# EasyEDA Pro project ProPrj_共享电动车中控.epro, schematic SCH

## Sheets
1 P1: Board Name: STM32F103C8T6; Create Date: 2024-09-26; Page Name: P1; Project Name: 电动车中控1; Schematic Name: SCH; Update Date: 2024-10-22
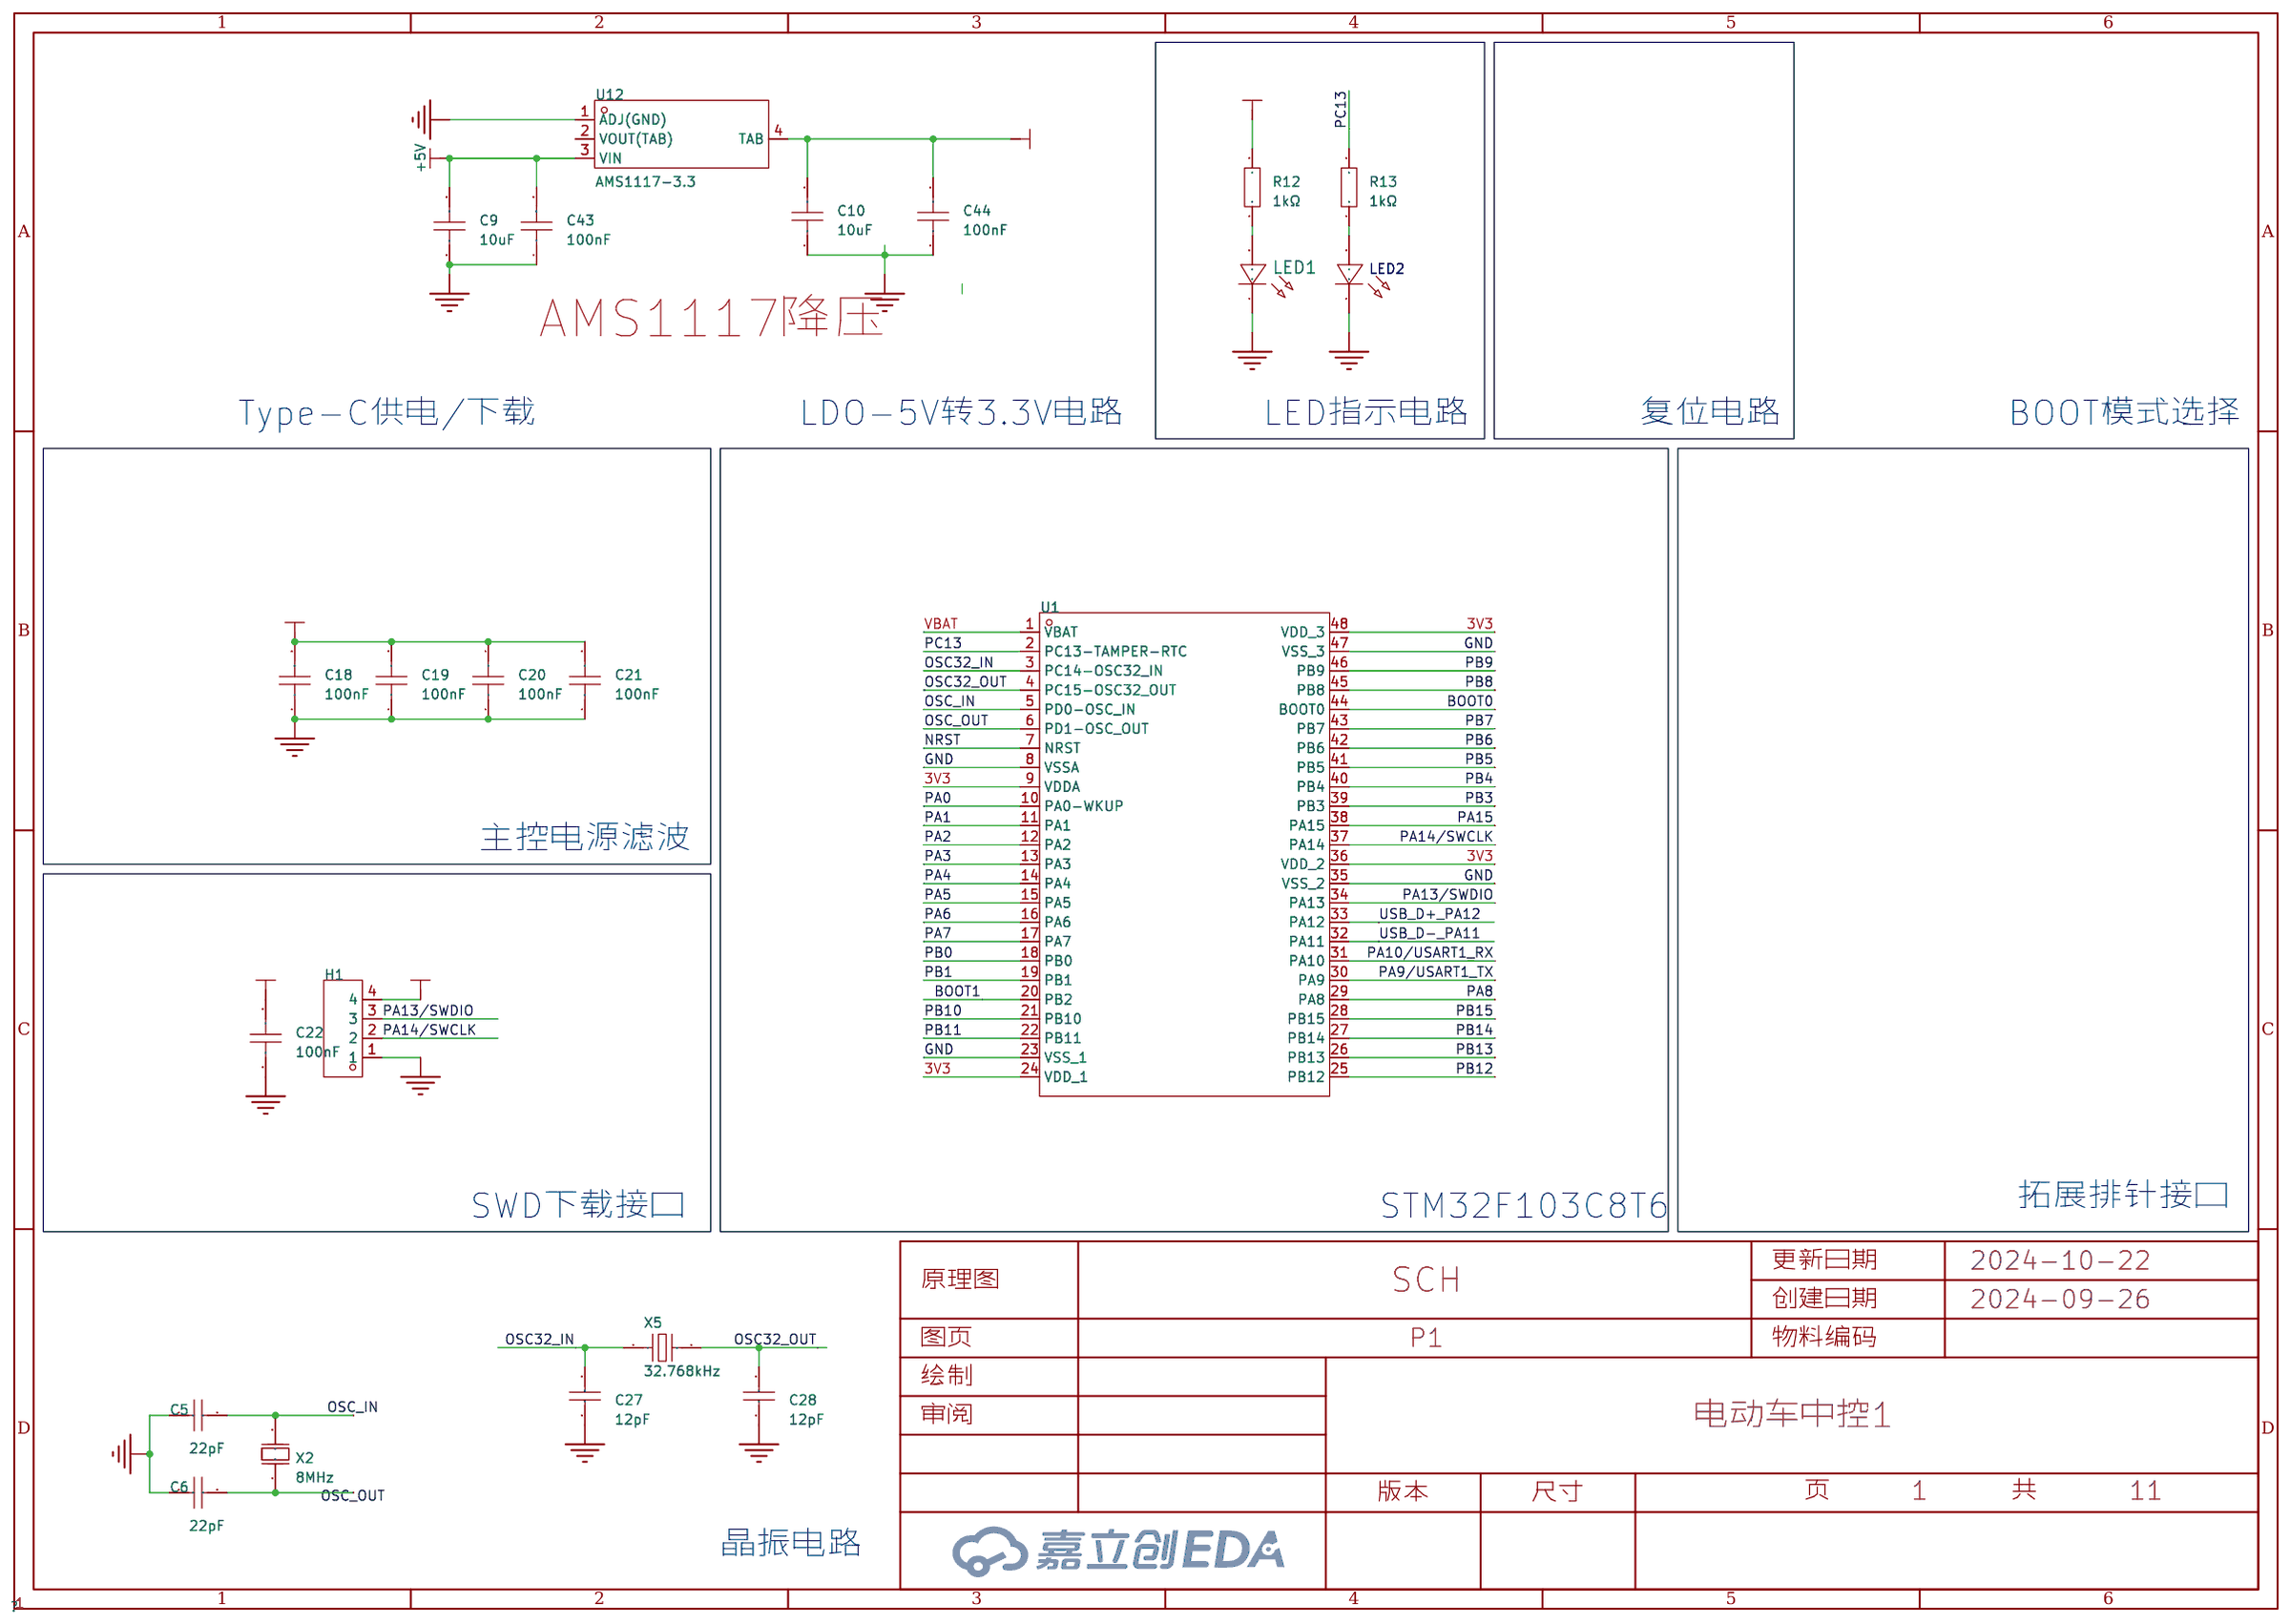
[diagram p0: P1]
2 电池锁驱动
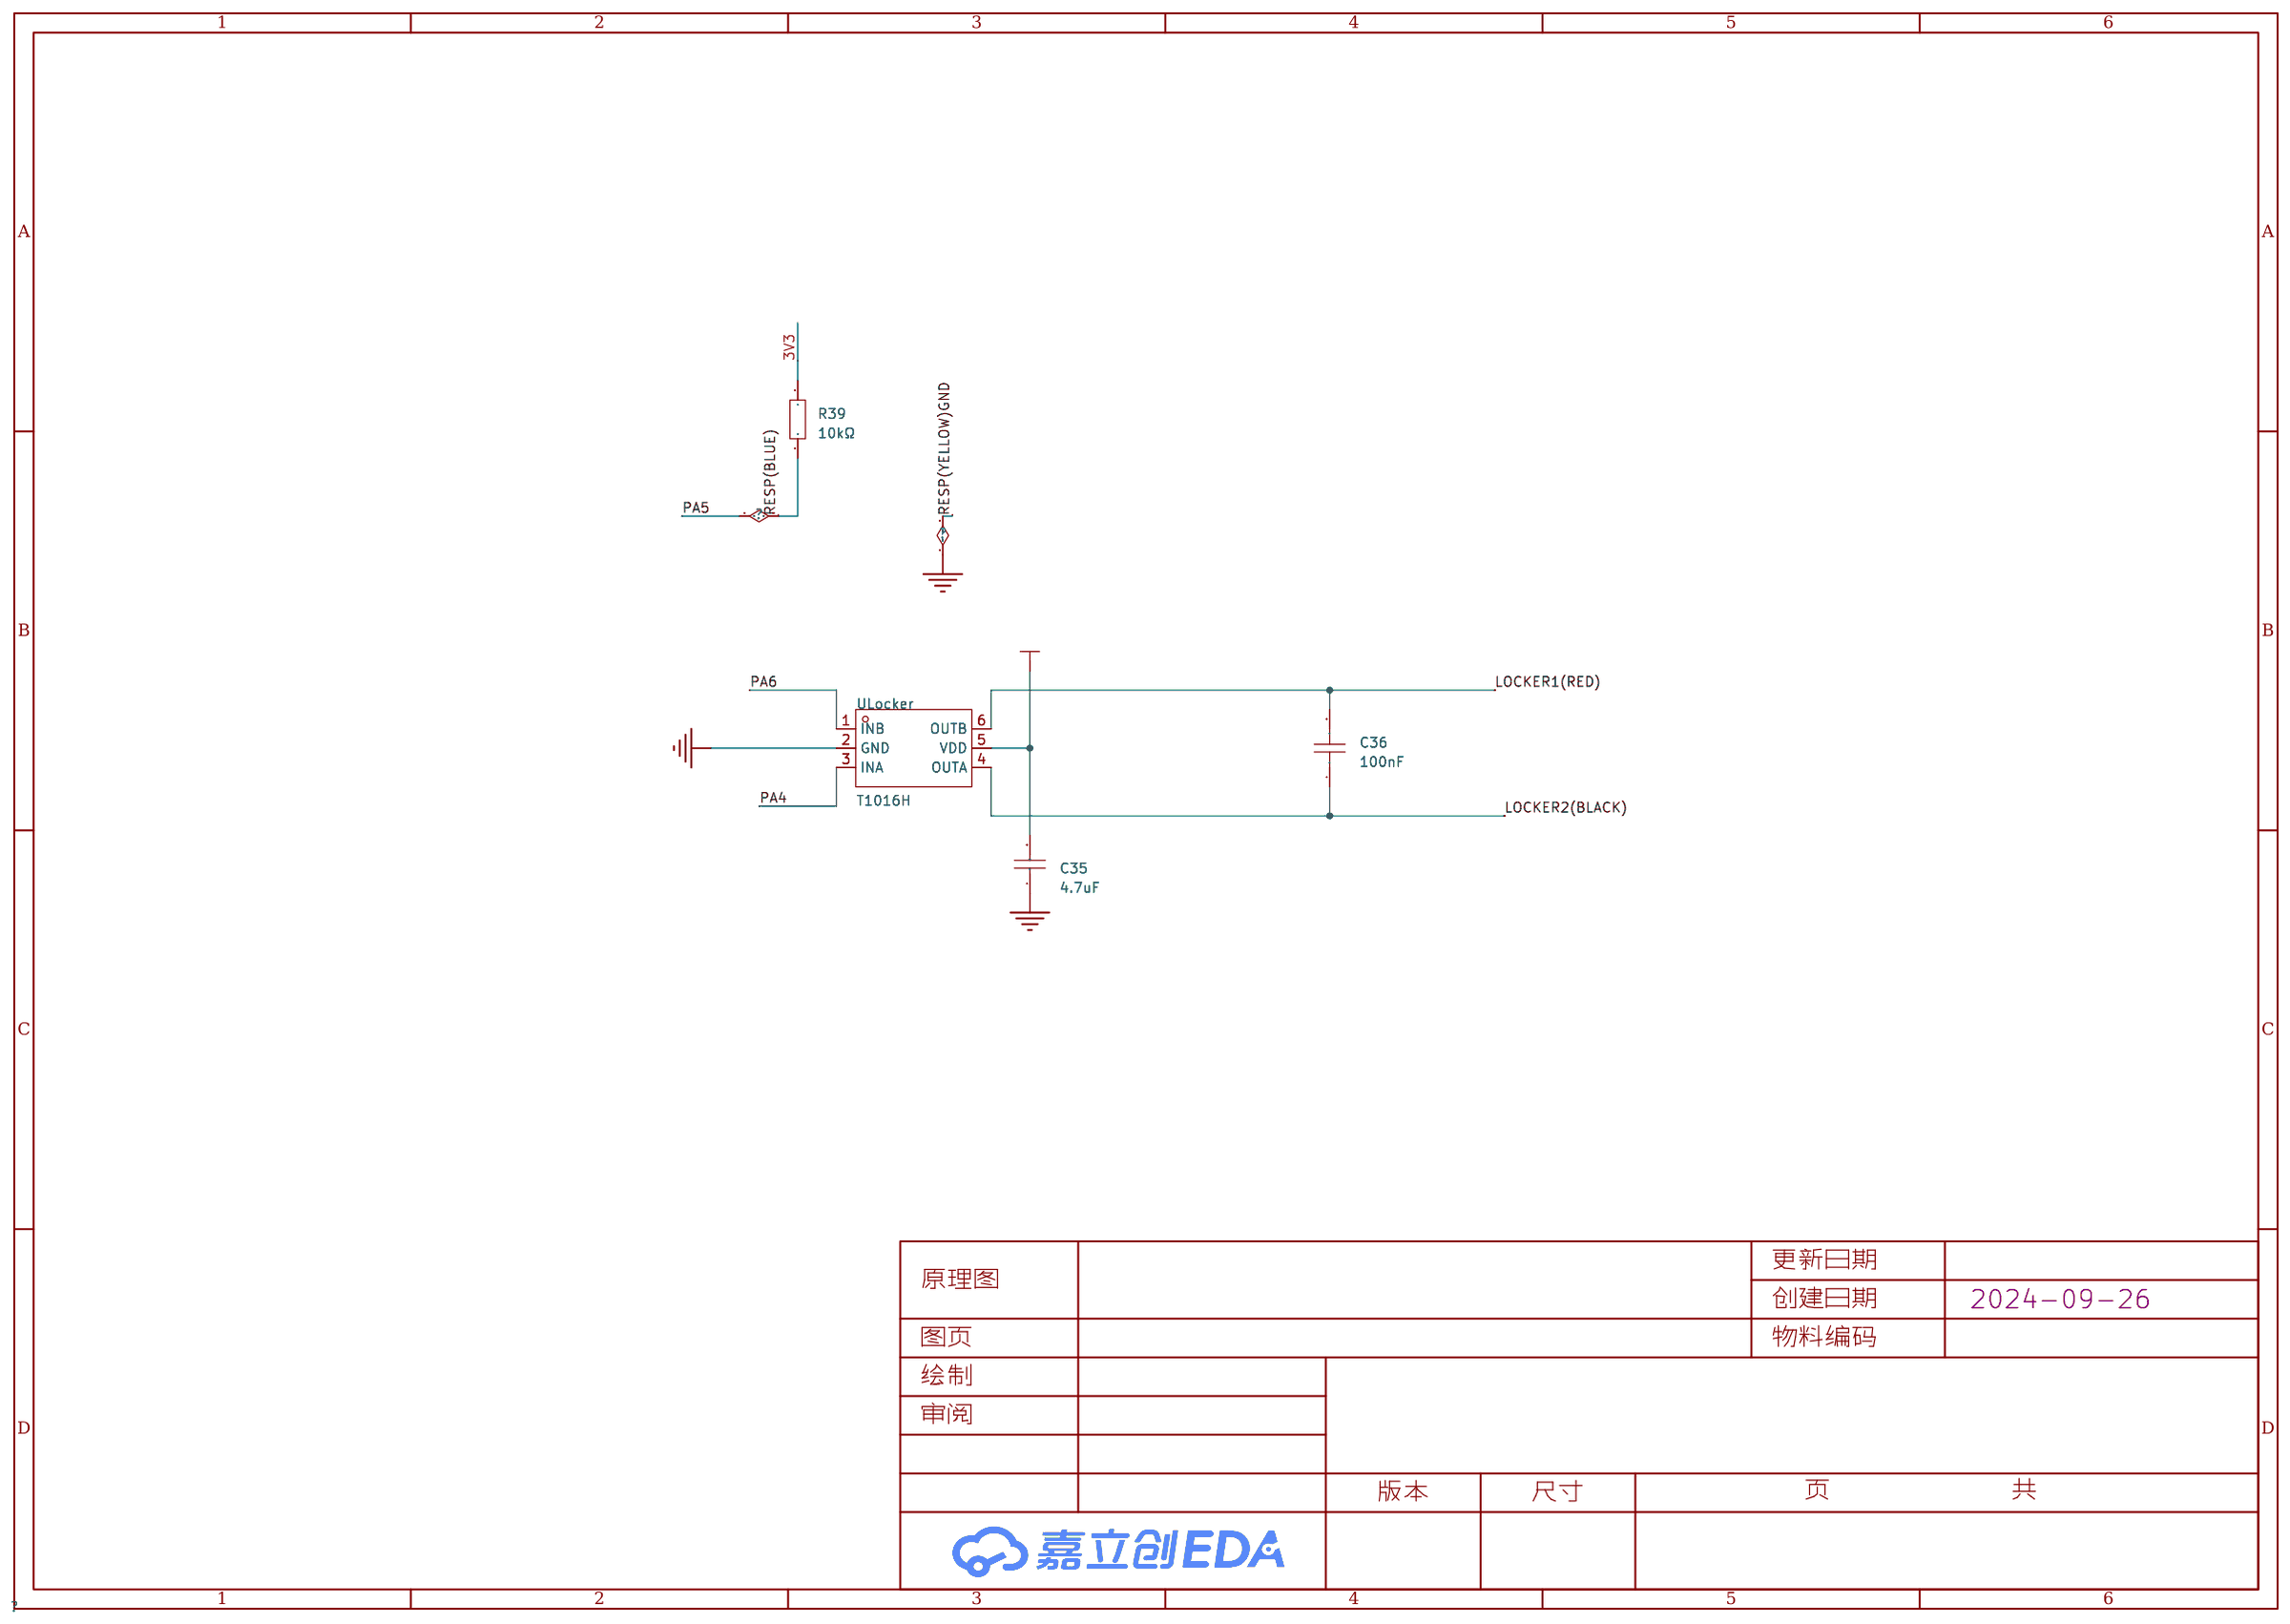
[diagram p1: 电池锁驱动]
3 蓝牙: Create Date: 2024-09-10
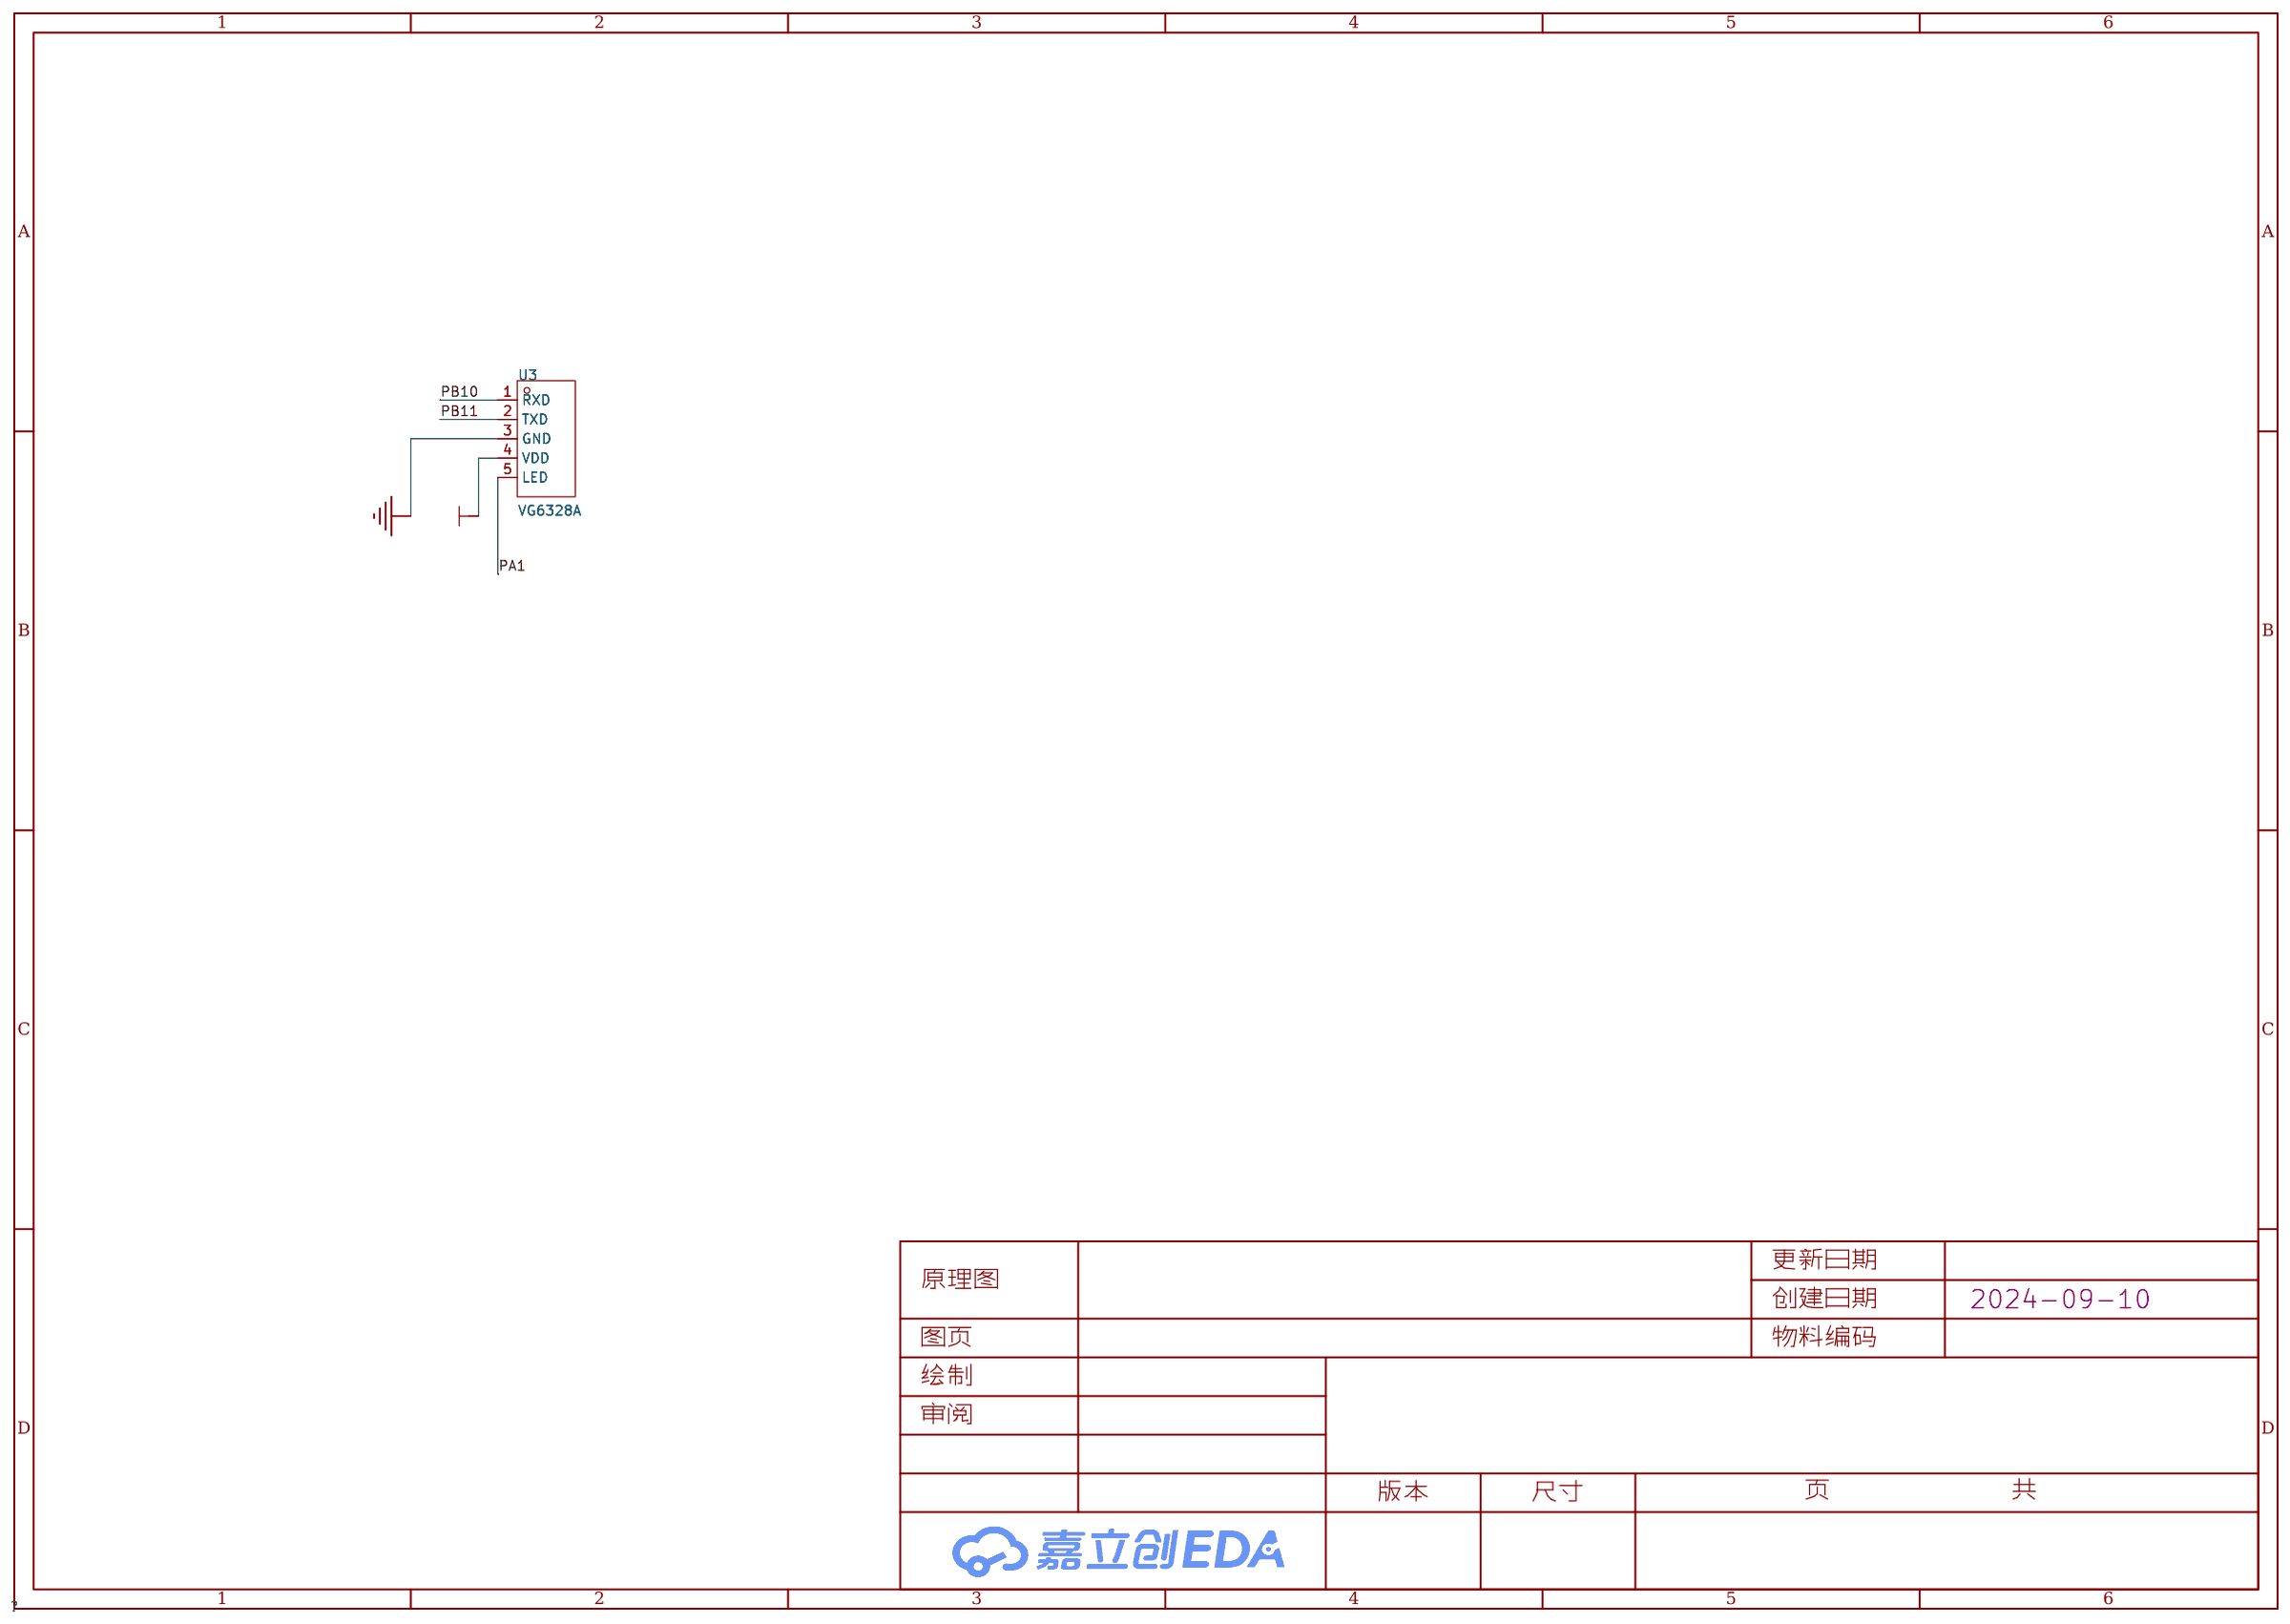
[diagram p2: 蓝牙]
4 DCDC降压
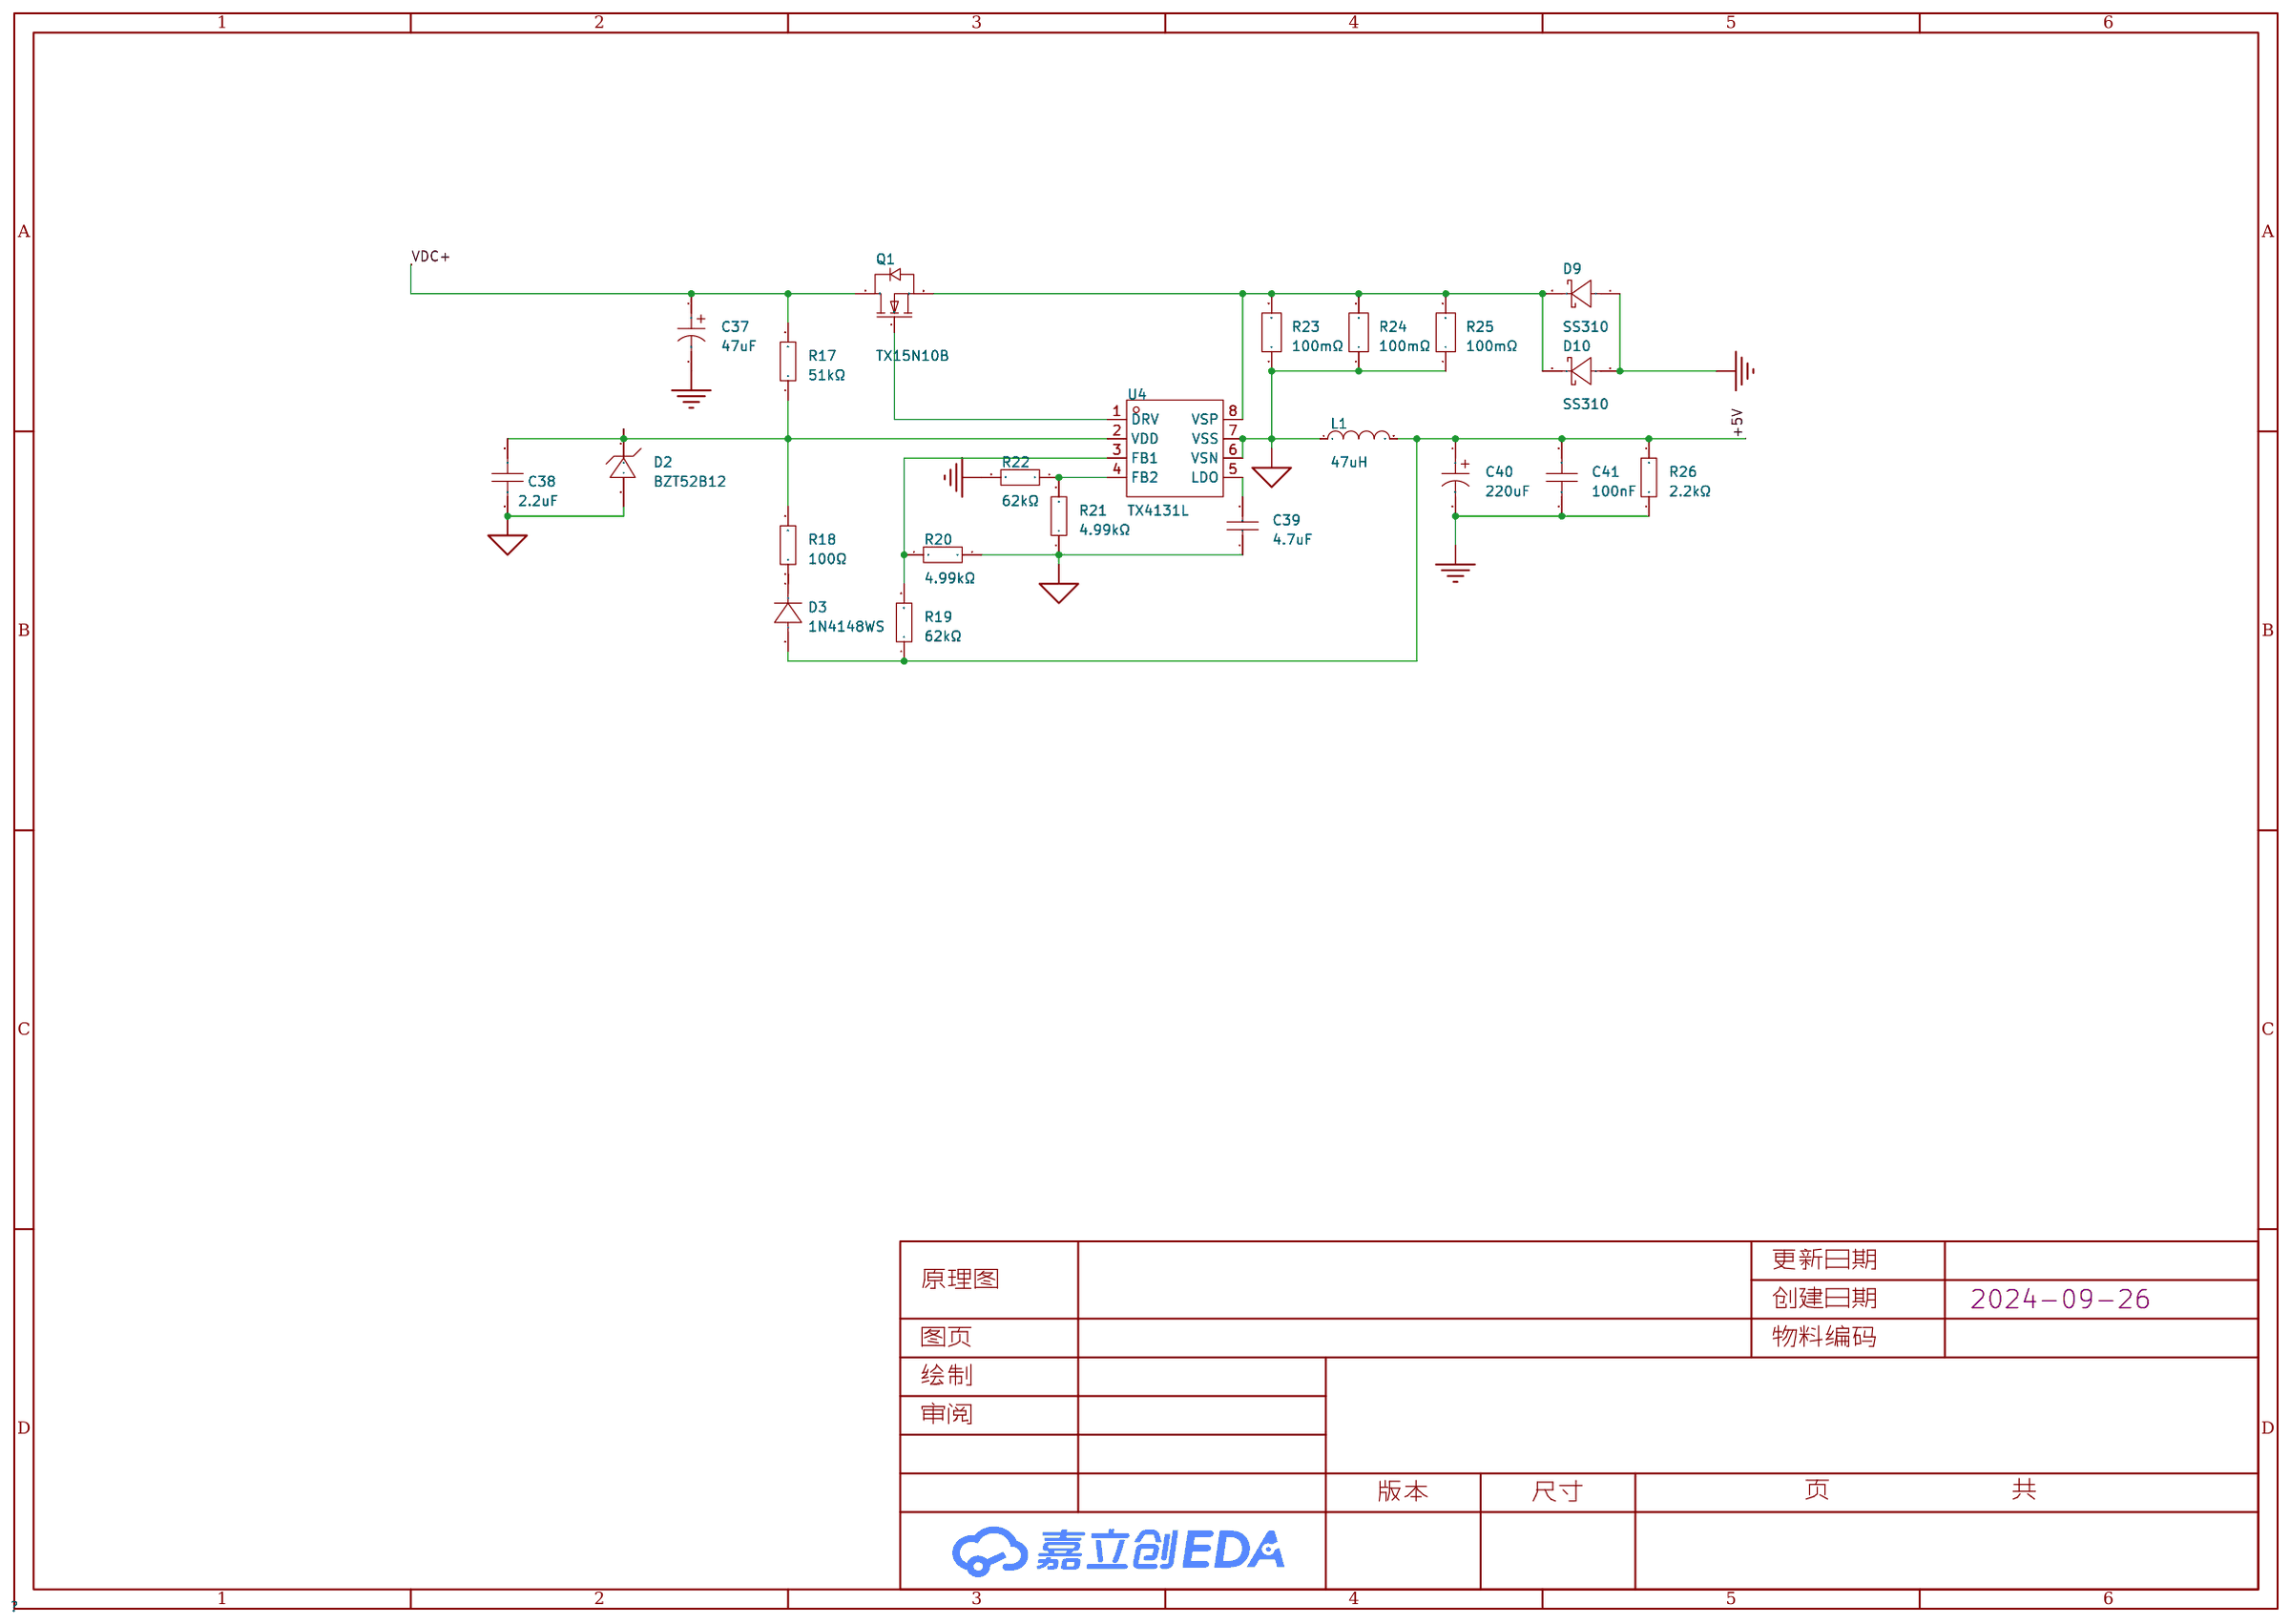
[diagram p3: DCDC降压]
5 485
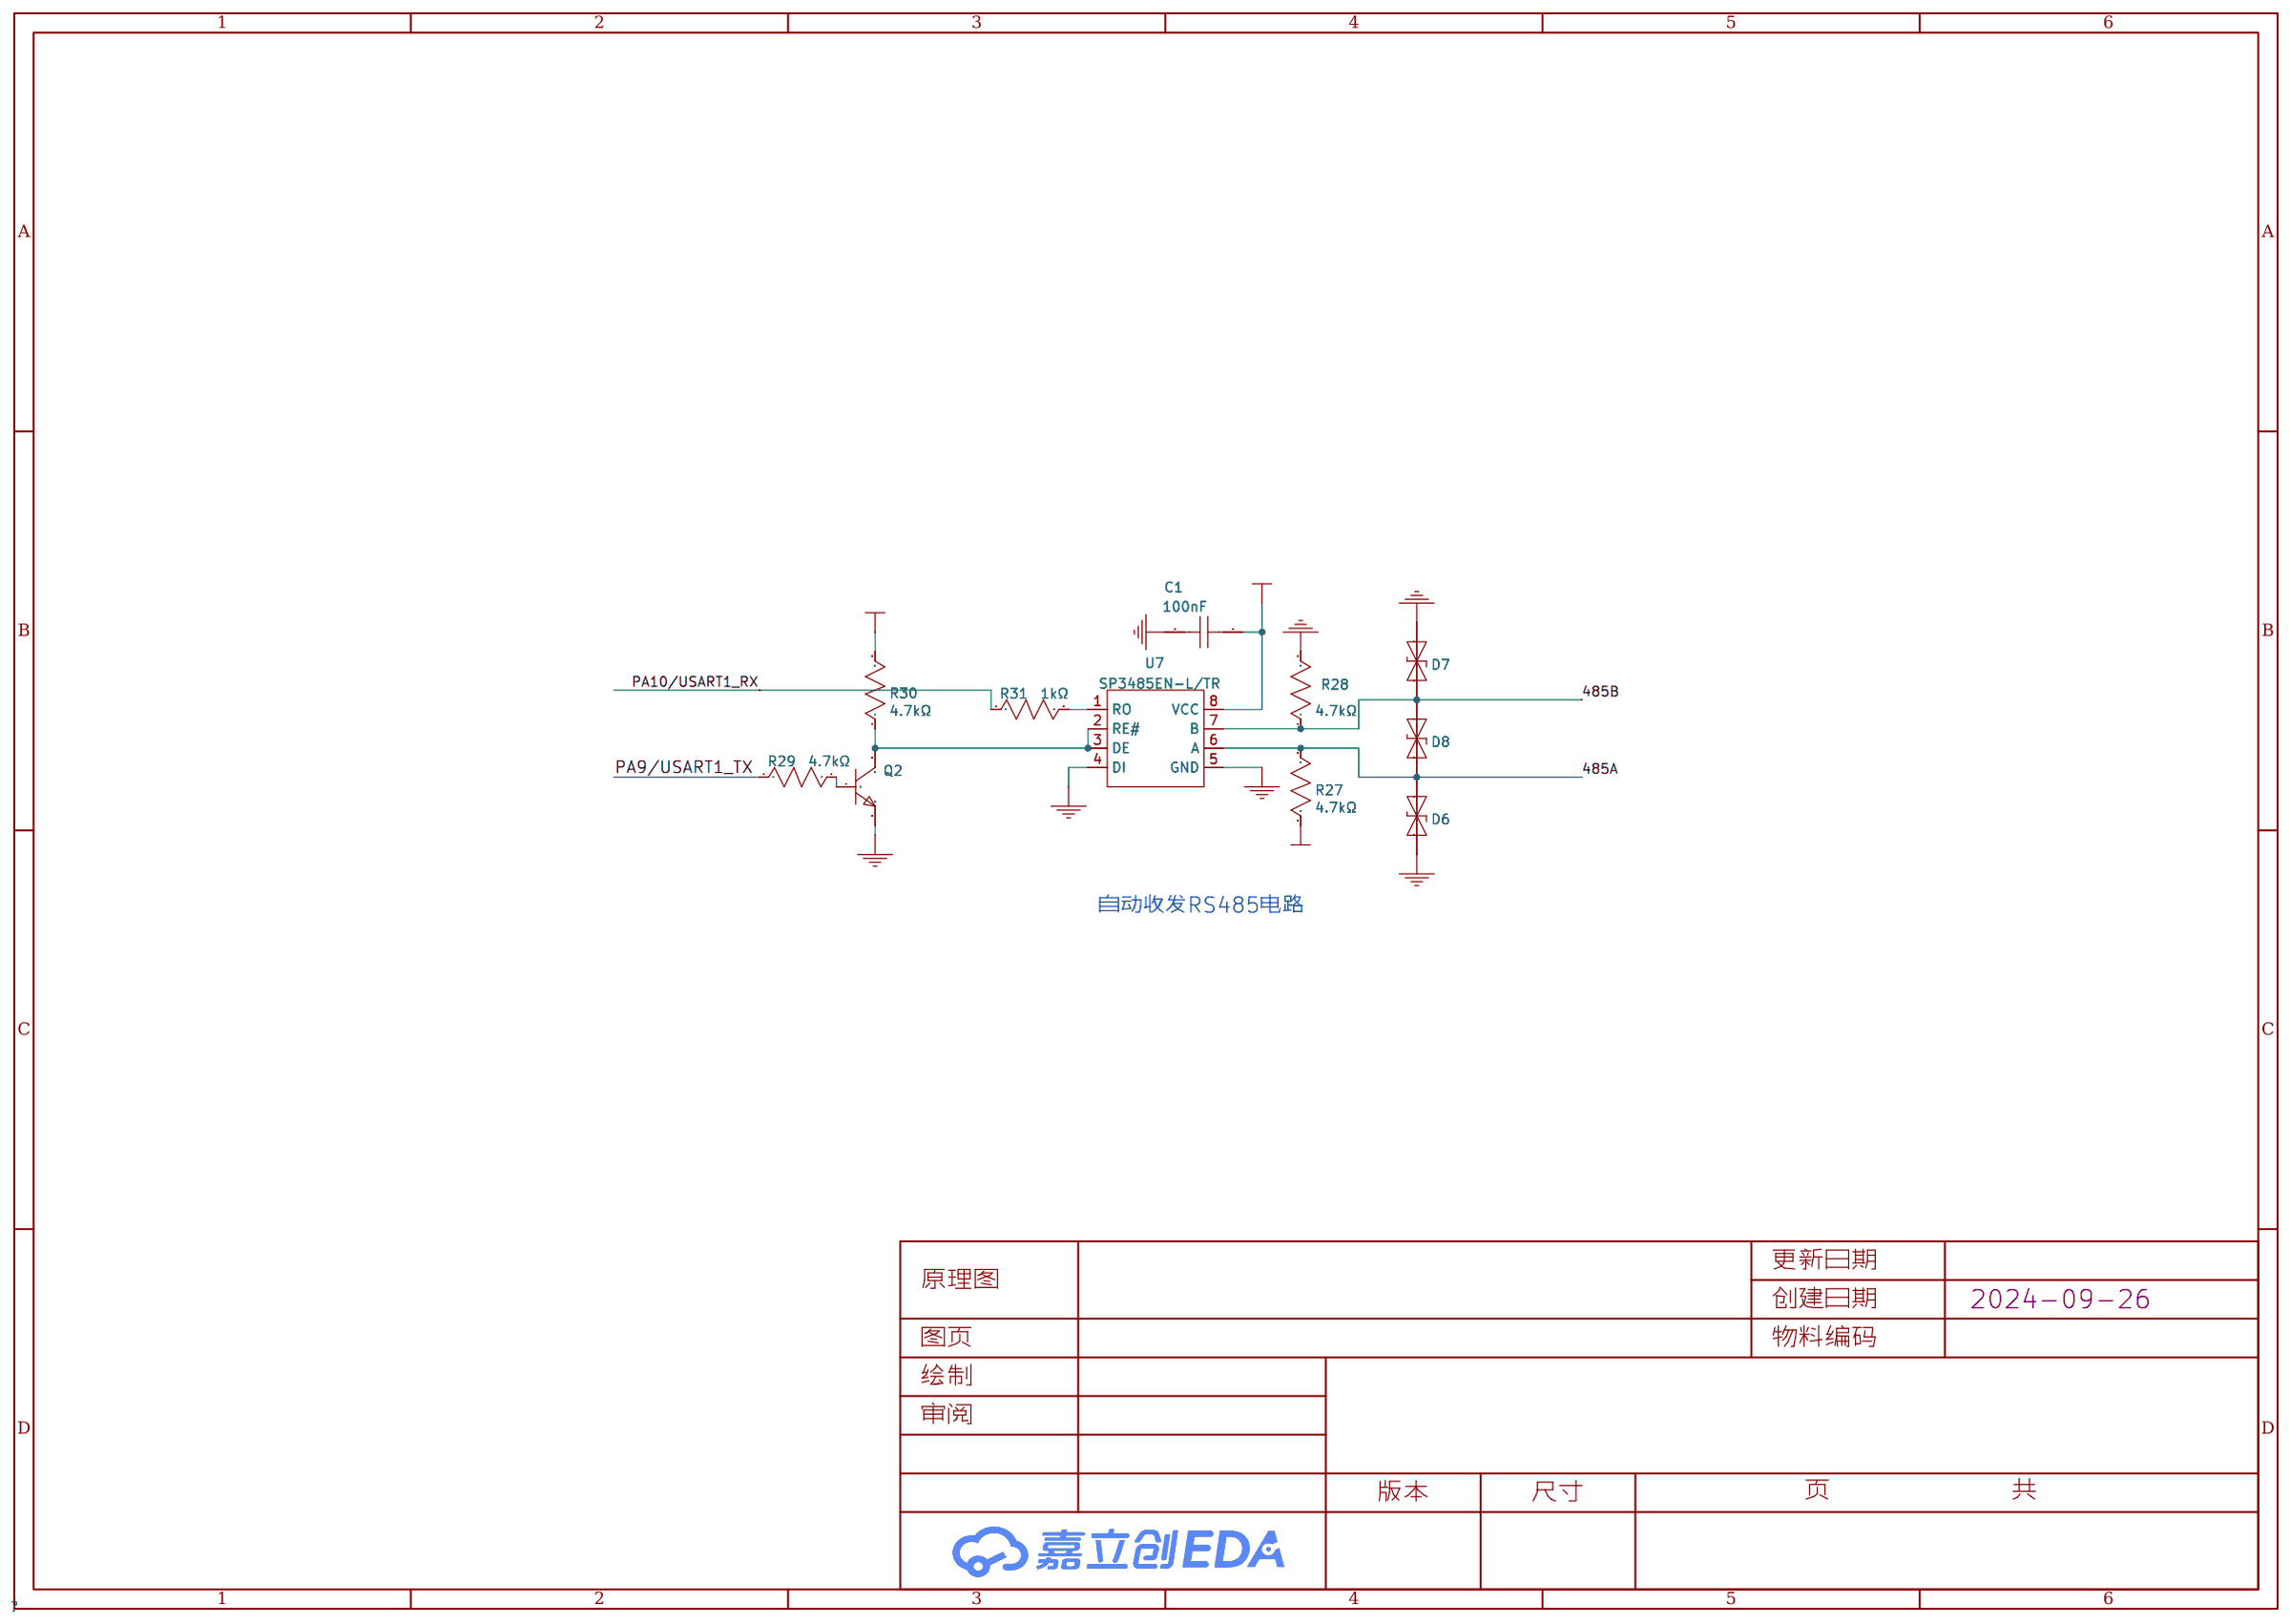
[diagram p4: 485]
6 接口
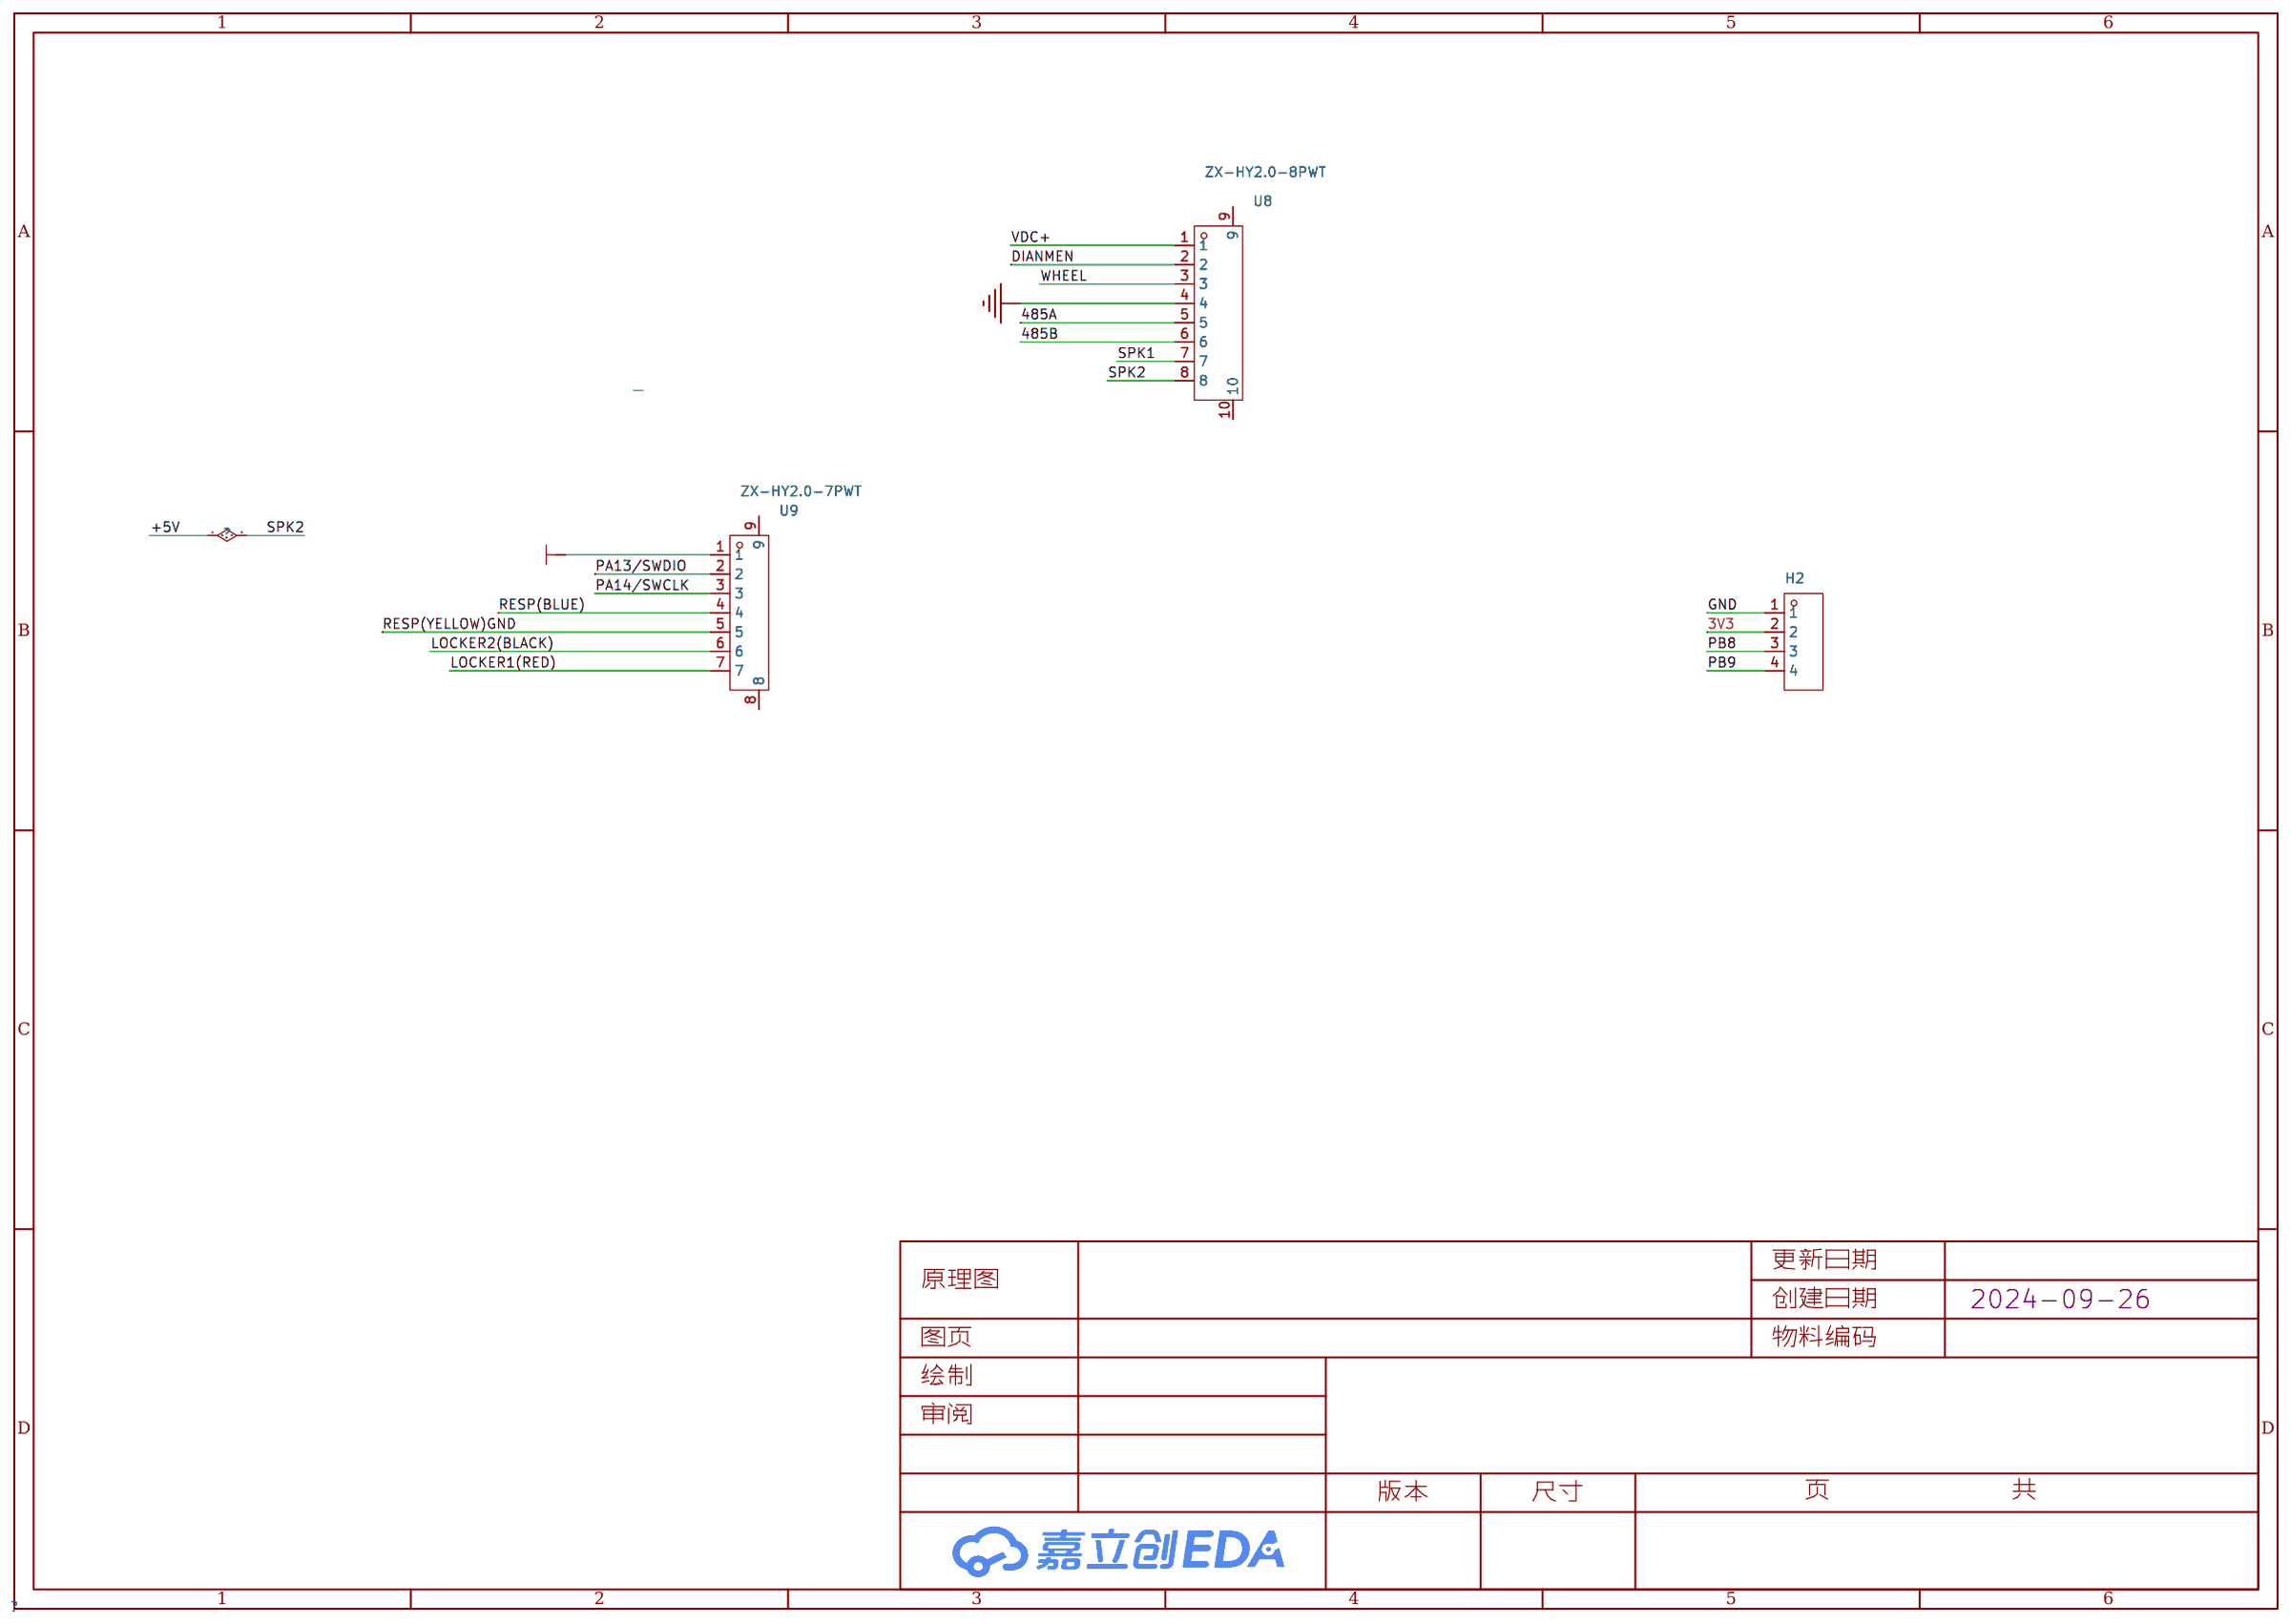
[diagram p5: 接口]
7 给控制器供电
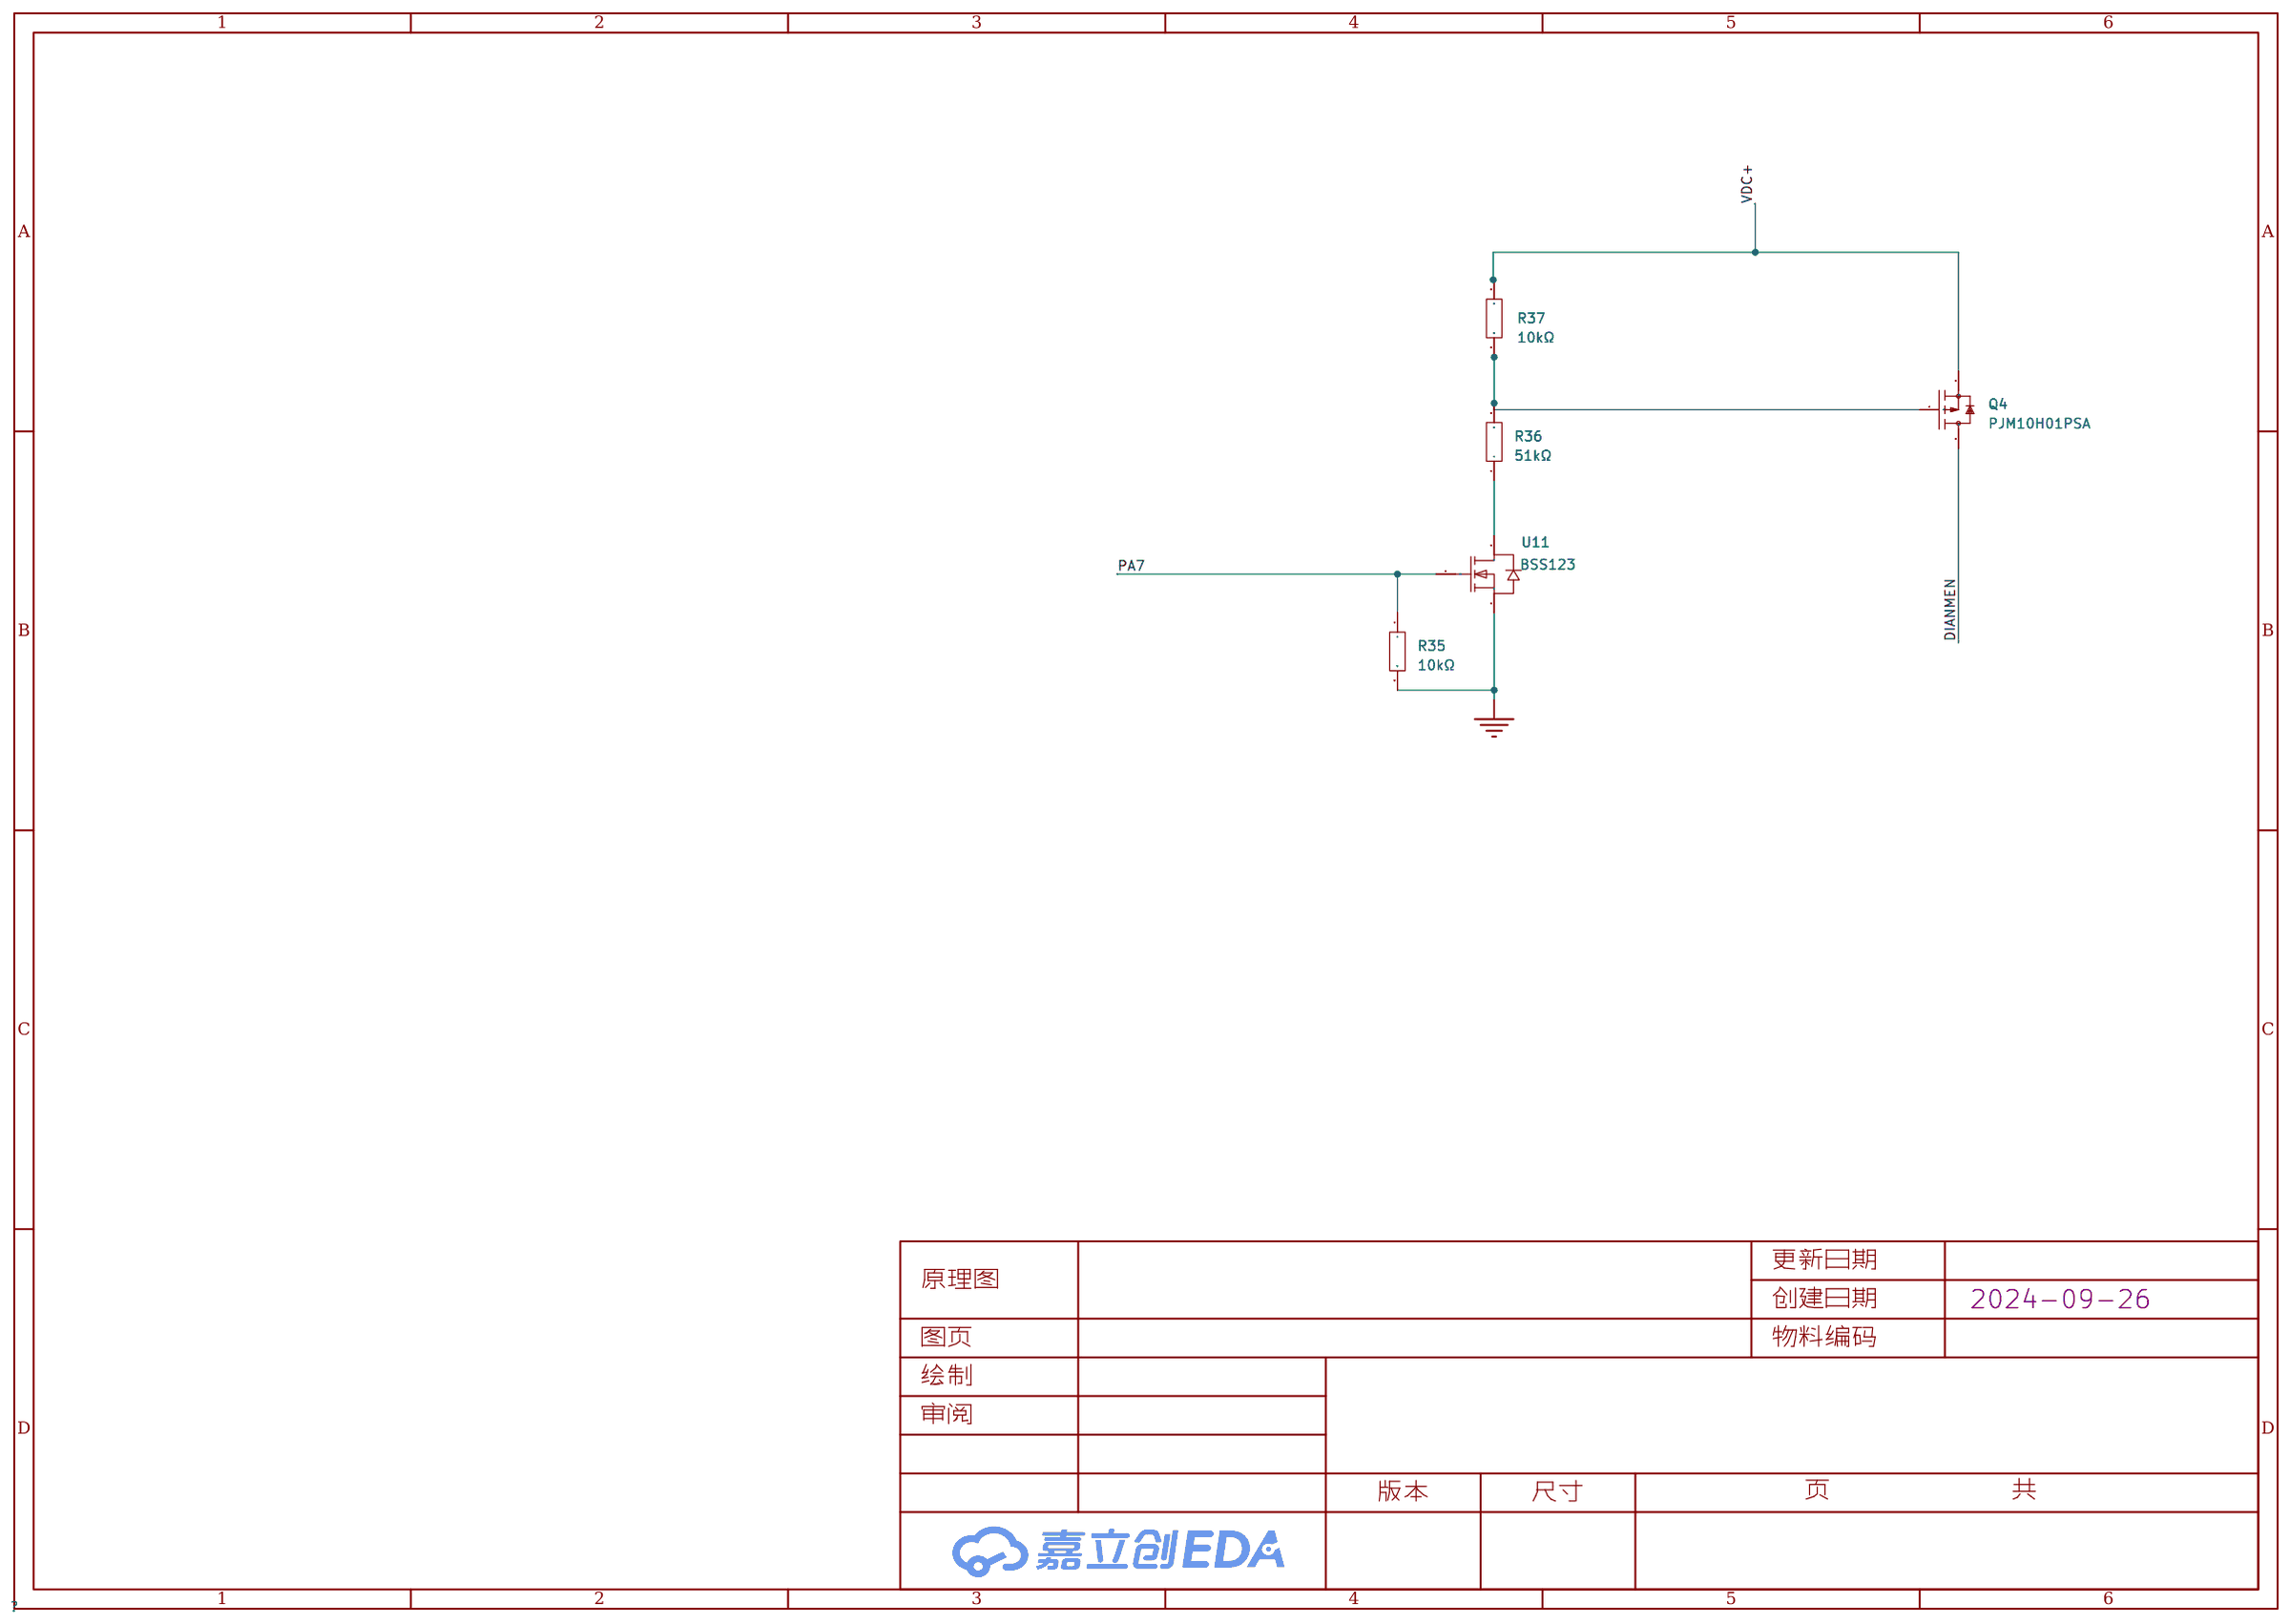
[diagram p6: 给控制器供电]
8 轮动信号
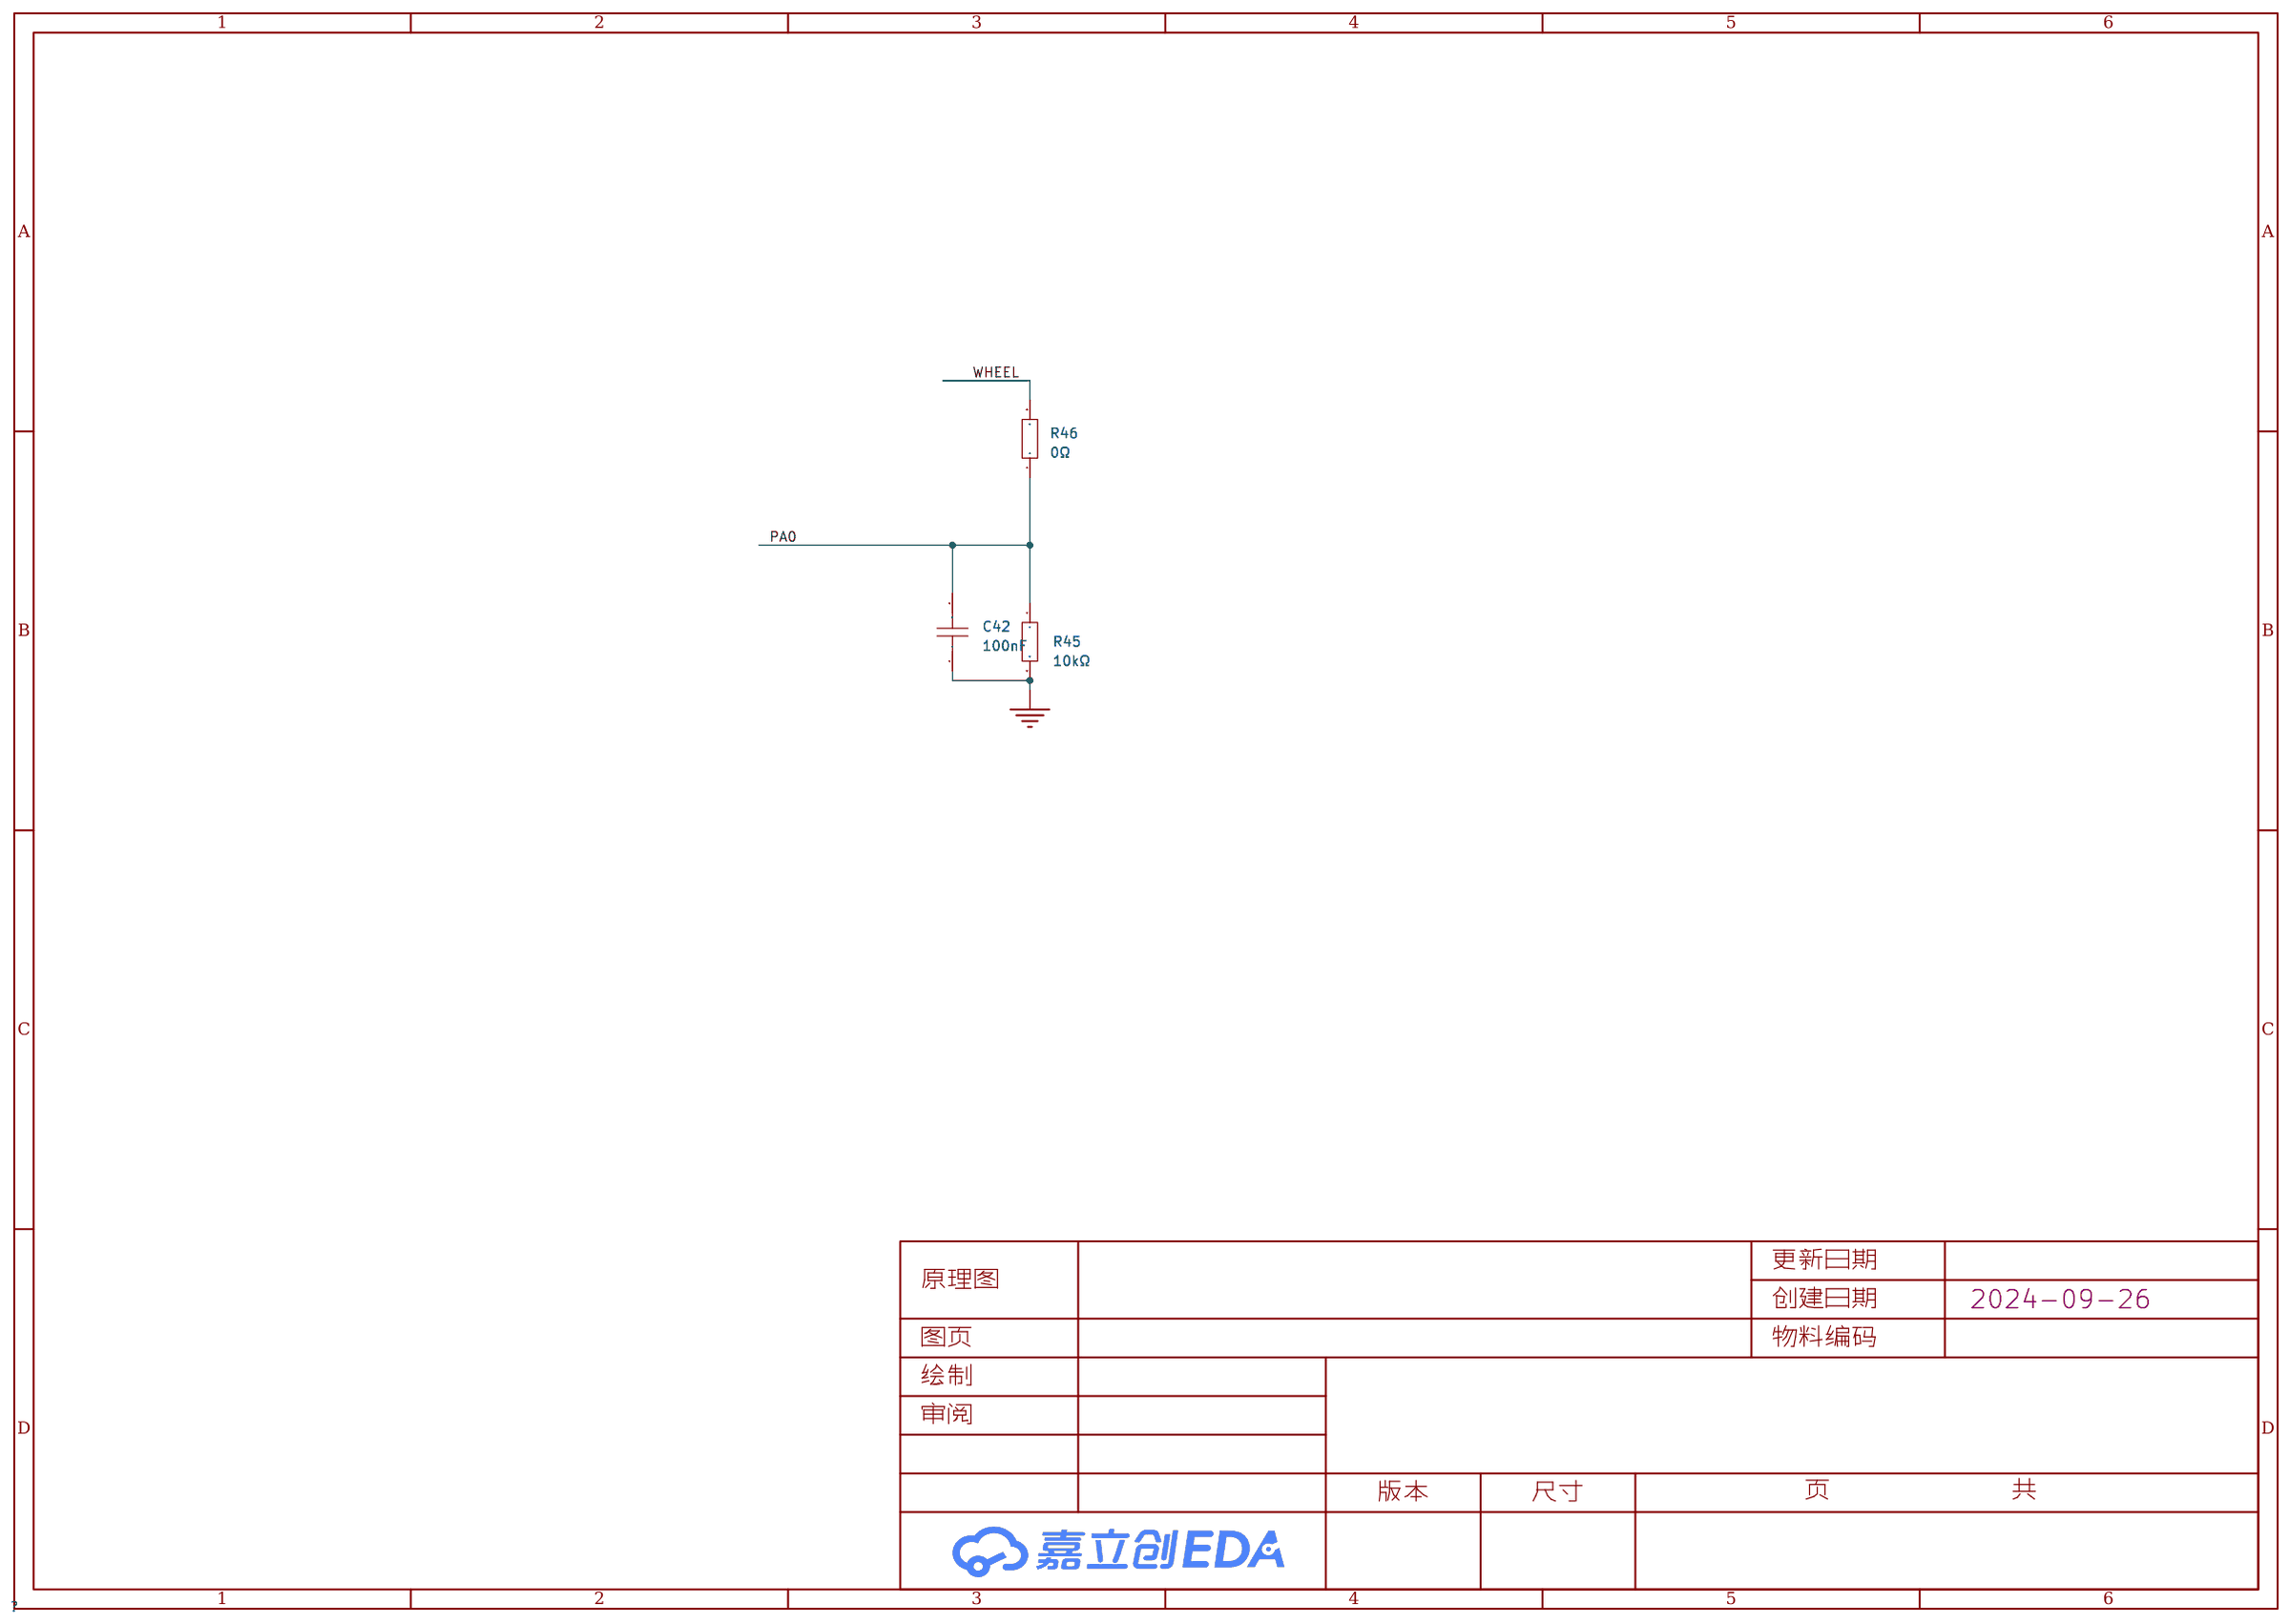
[diagram p7: 轮动信号]
9 4GGPS: Create Date: 2024-09-23
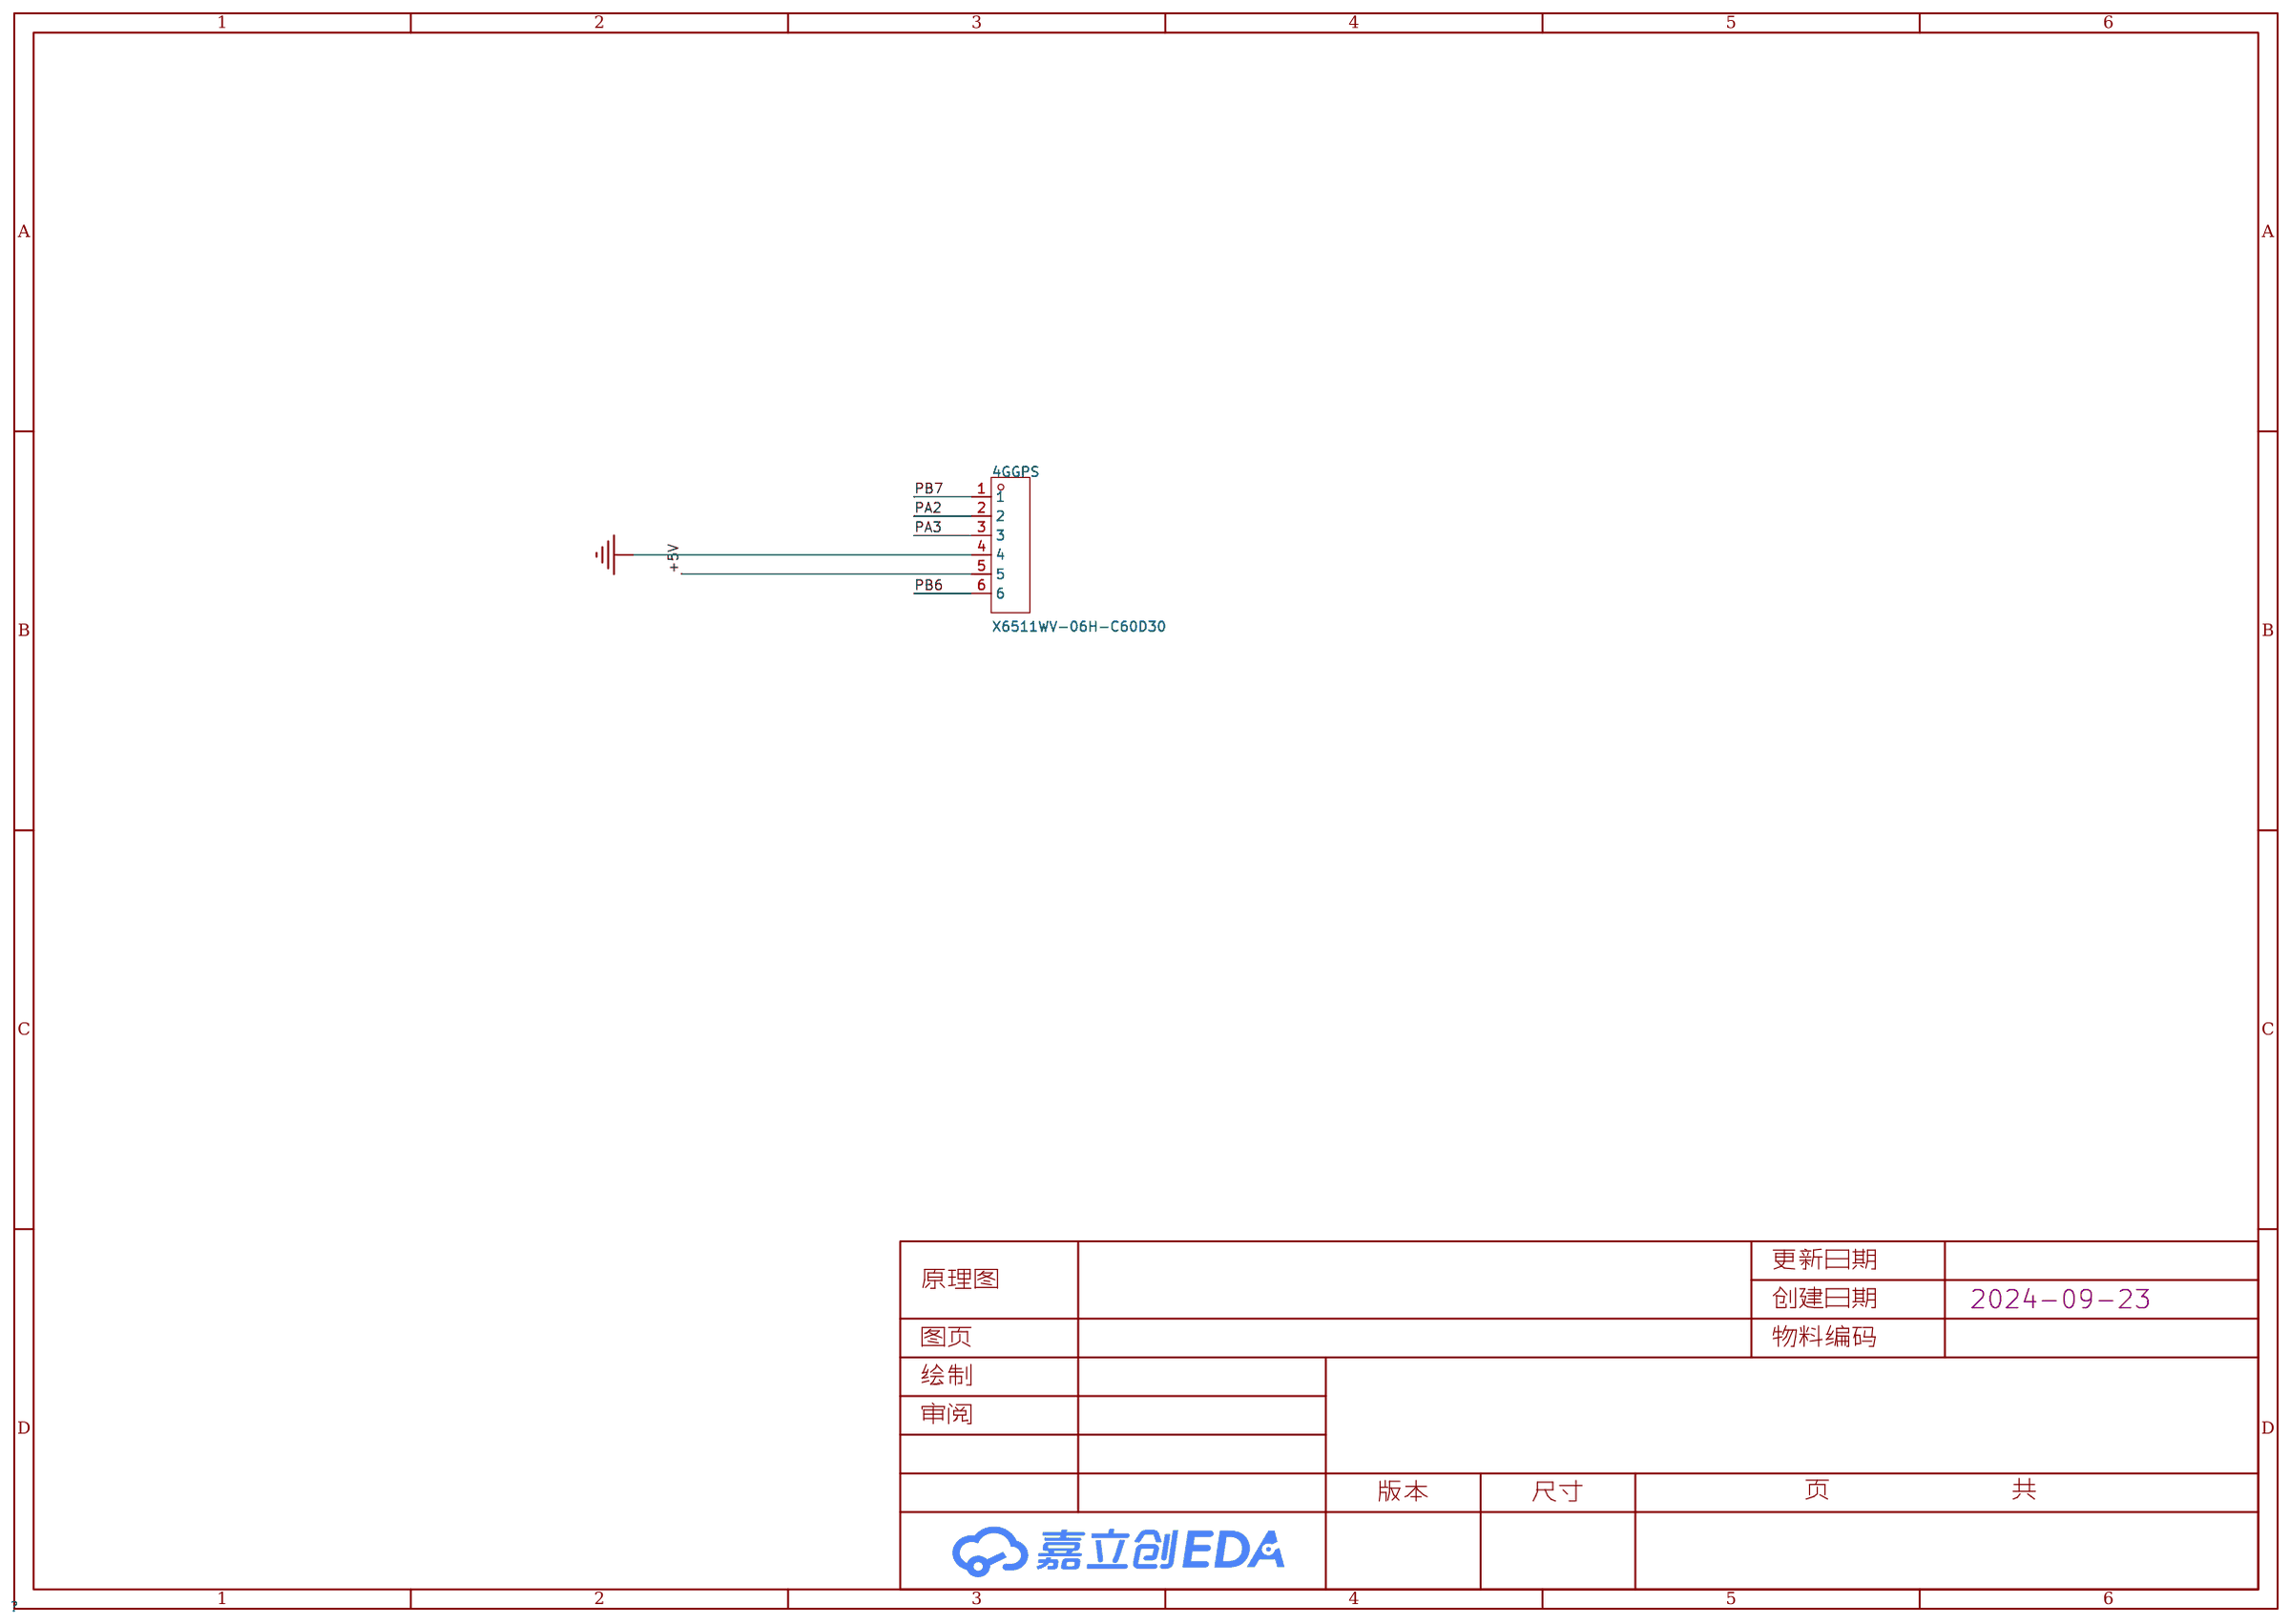
[diagram p8: 4GGPS]
10 蜂鸣器: Create Date: 2024-10-05
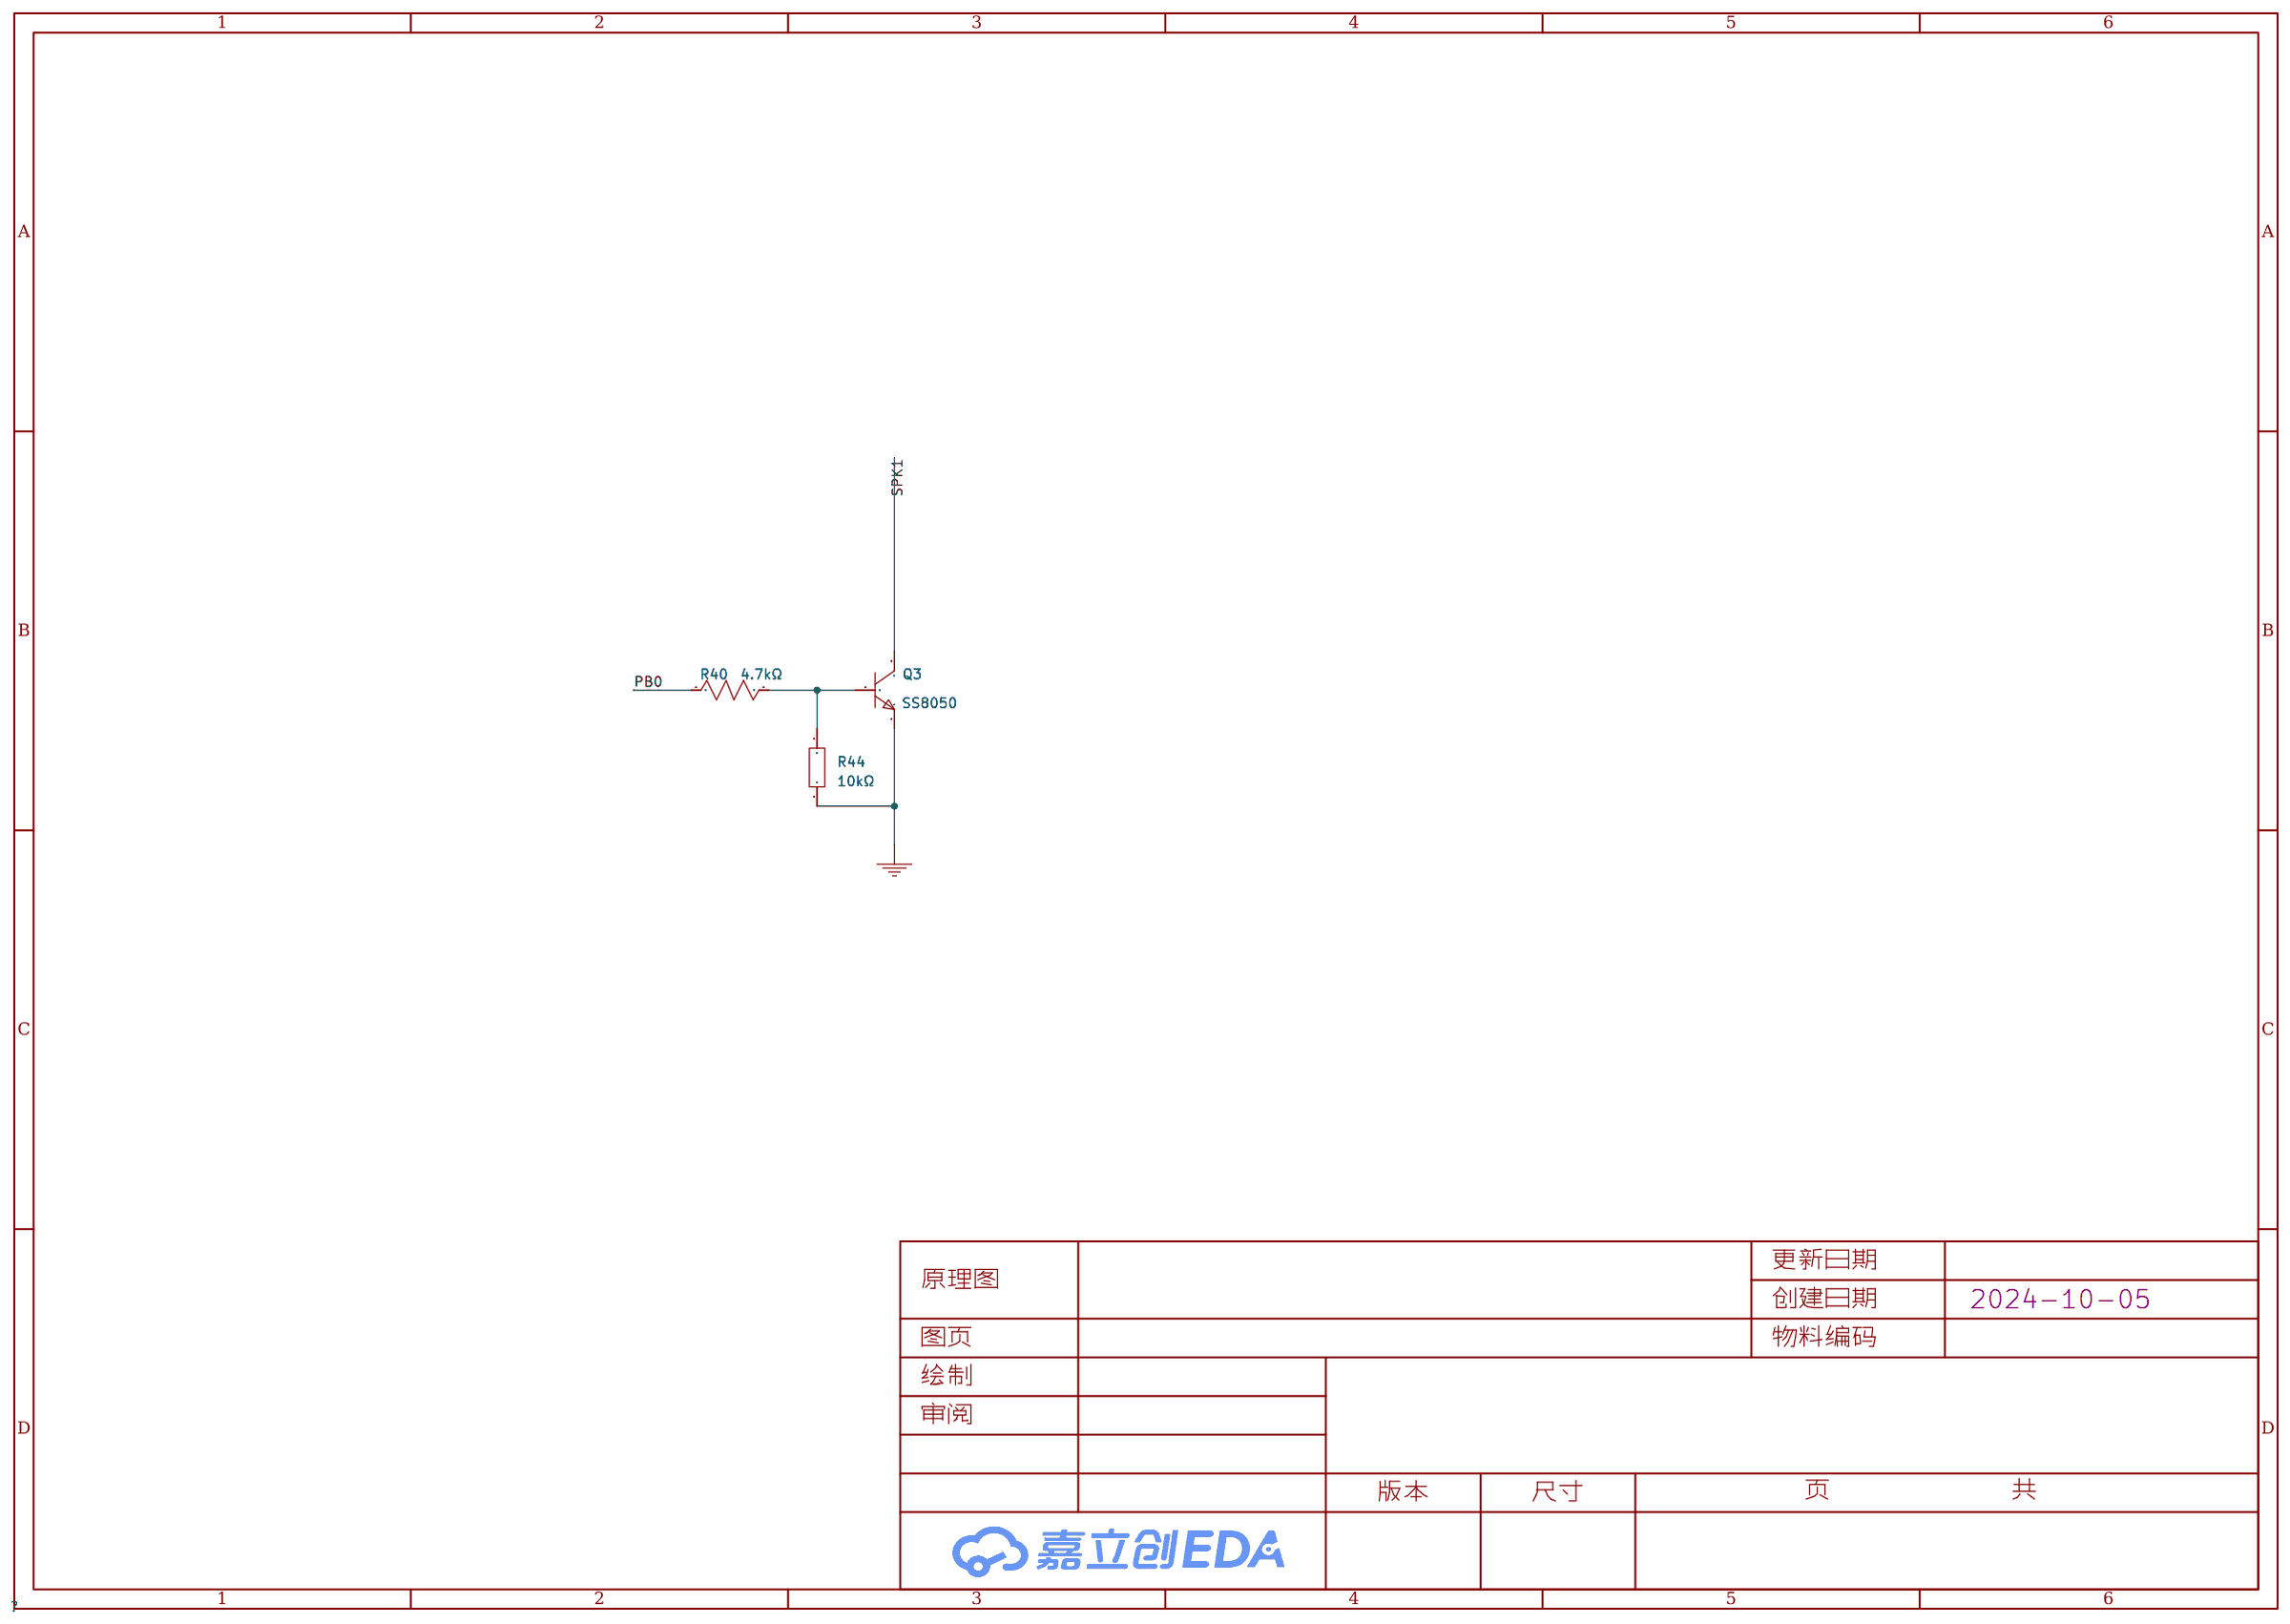
[diagram p9: 蜂鸣器]
11 电池电压: Create Date: 2024-10-05
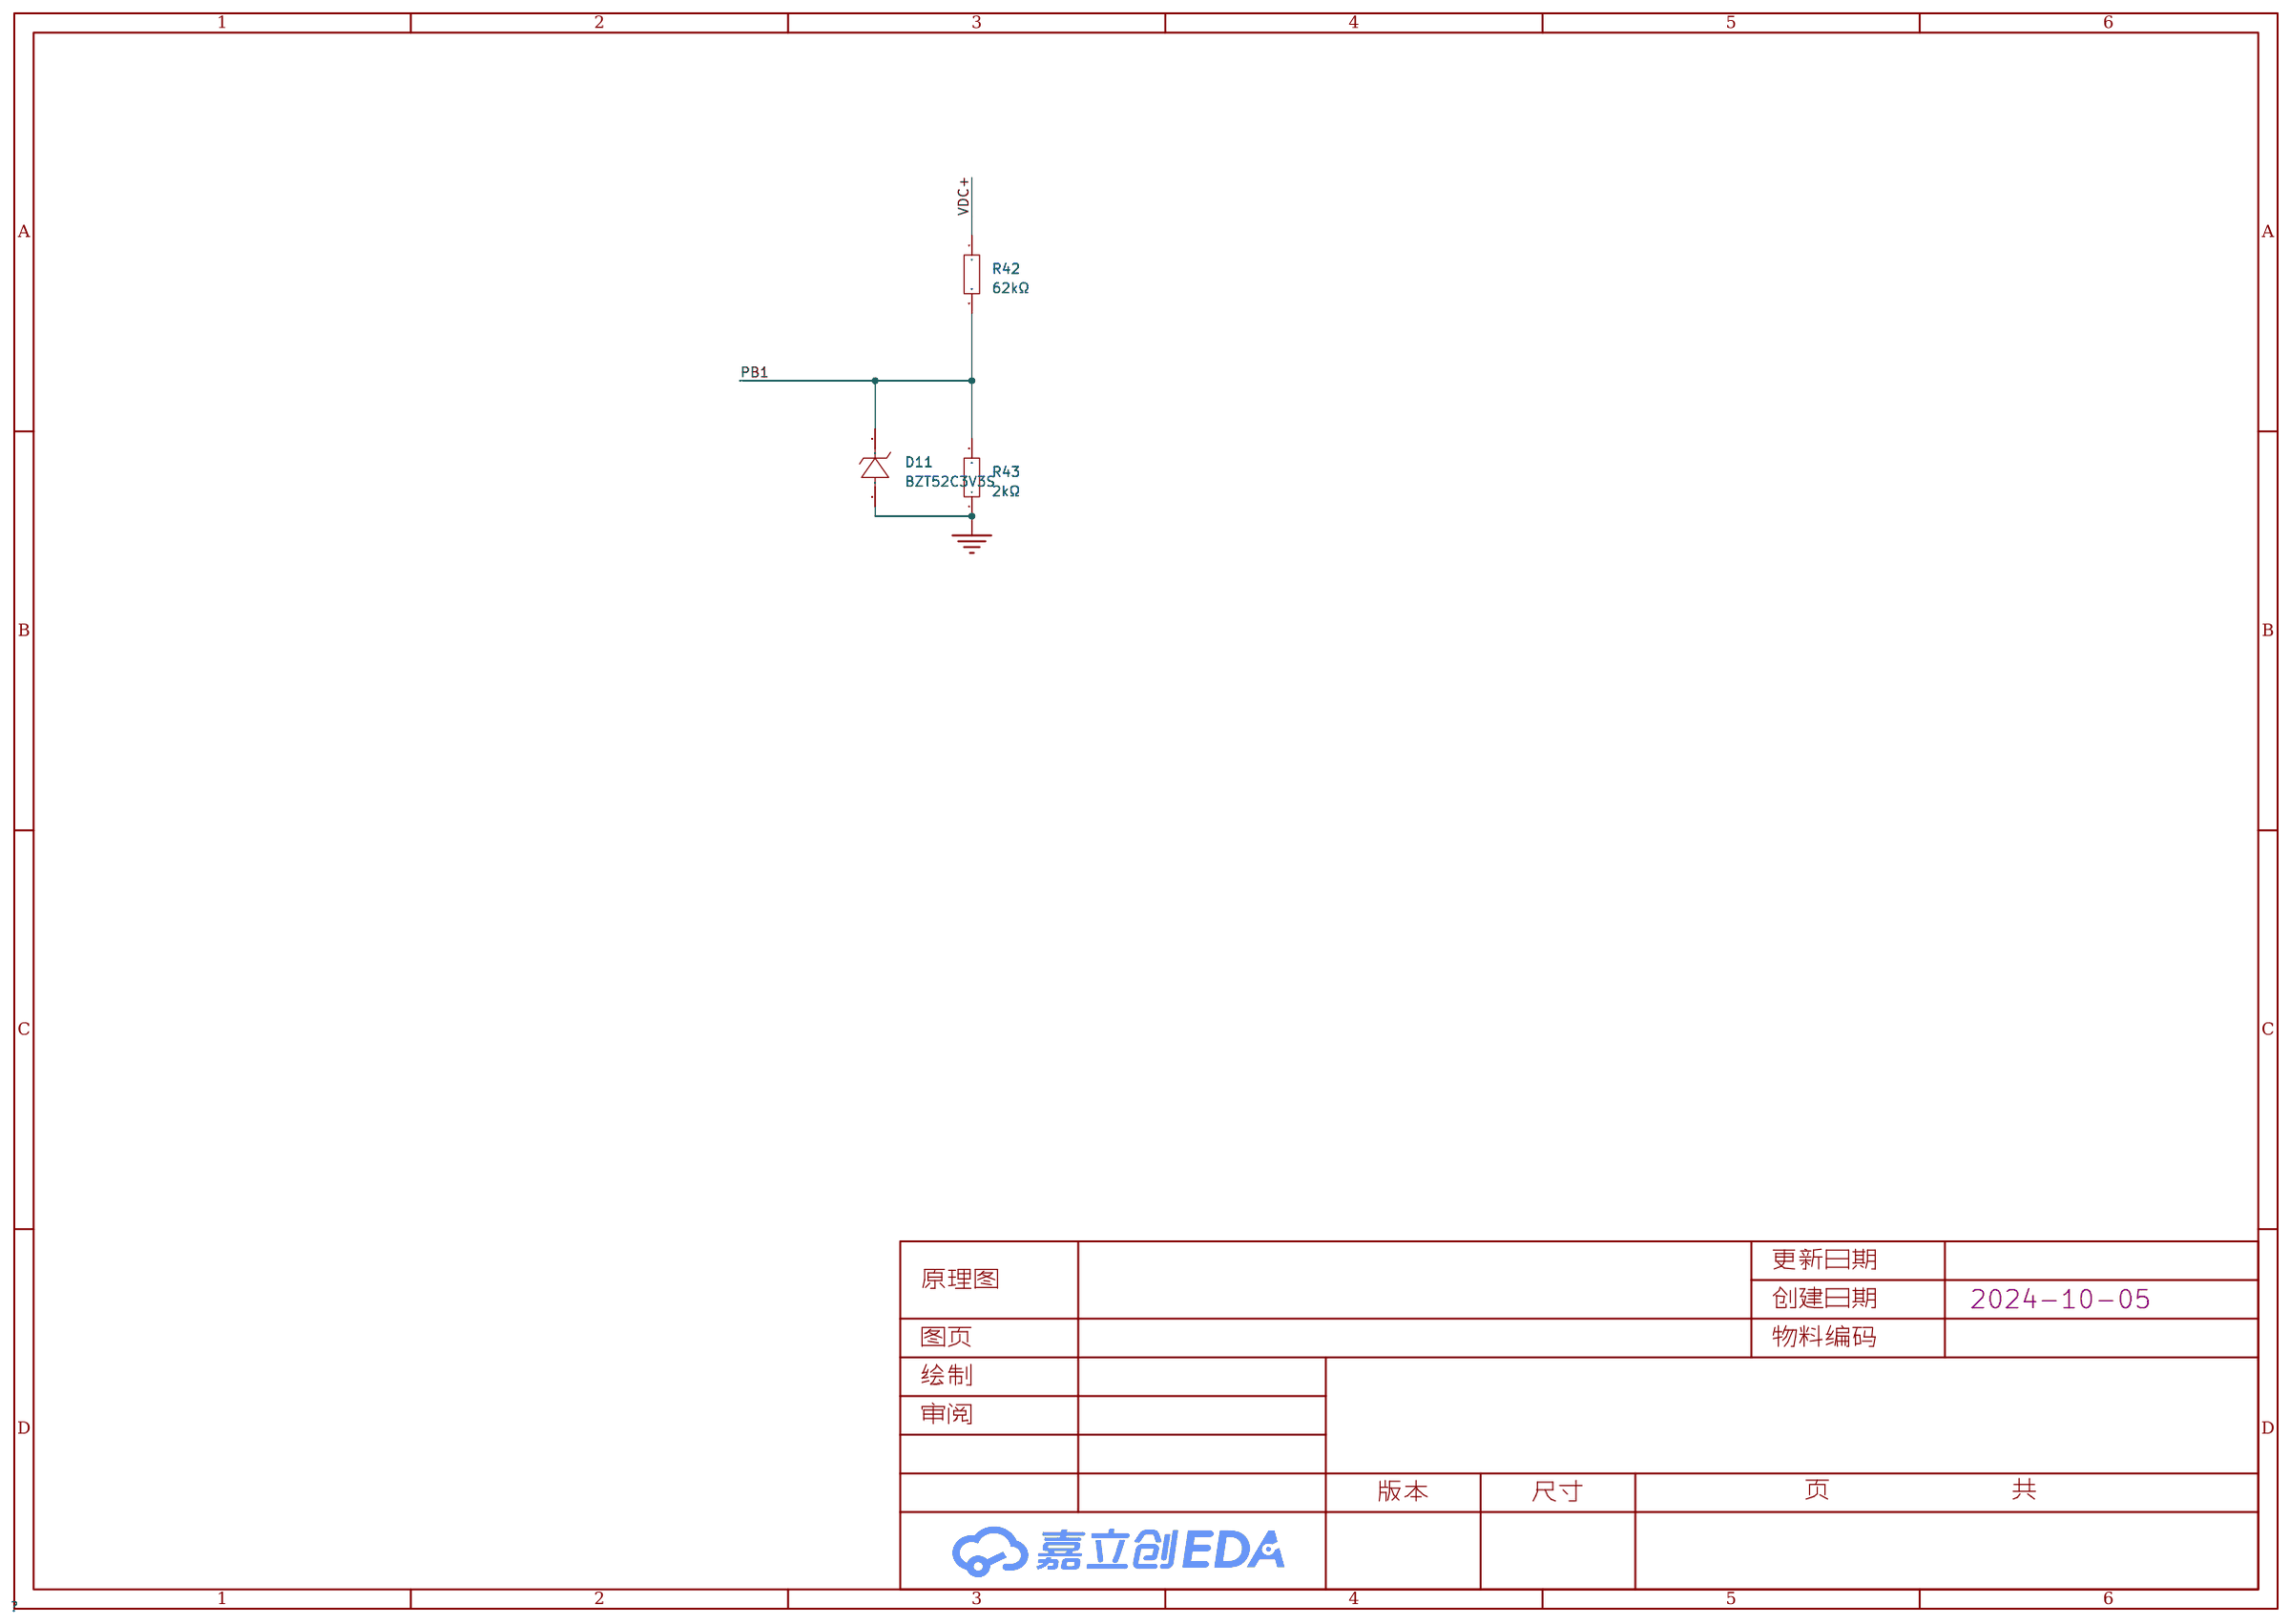
[diagram p10: 电池电压]

## Parts
sheet 4GGPS
4GGPS  X6511WV-06H-C60D30  [HDR-TH_6P-P2.54-V-M]
sheet 485
C1  100nF  [C0805]
D6  SMBJ6.5CA  [SMB_L4.6-W3.5-LS5.3-BI]
D7  SMBJ6.5CA  [SMB_L4.6-W3.5-LS5.3-BI]
D8  SMBJ6.5CA  [SMB_L4.6-W3.5-LS5.3-BI]
Q2  SS8050  [SOT-23-3_L2.9-W1.3-P1.90-LS2.4-BR]
R27  4.7kΩ  [R0805]
R28  4.7kΩ  [R0805]
R29  4.7kΩ  [R0805]
R30  4.7kΩ  [R0805]
R31  1kΩ  [R0805]
U7  SP3485EN-L/TR  [SOIC-8_L5.0-W4.0-P1.27-LS6.0-BL]
sheet DCDC降压
C37  47uF  [CAP-SMD_BD10.0-L10.3-W10.3-LS11.3-FD]
C38  2.2uF  [C0805]
C39  4.7uF  [C0805]
C40  220uF  [CAP-SMD_BD6.3-L6.6-W6.6-FD]
C41  100nF  [C0805]
D2  BZT52B12  [SOD-123_L2.7-W1.6-LS3.7-RD]
D3  1N4148WS  [SOD-323_L1.8-W1.3-LS2.5-RD]
D9  SS310  [SMA_L4.3-W2.6-LS5.0-FD]
D10  SS310  [SMA_L4.3-W2.6-LS5.0-FD]
L1  47uH  [IND-SMD_L7.0-W6.6_FXL0630]
Q1  TX15N10B  [TO-252_L6.5-W6.1-P4.58-LS9.9-BR]
R17  51kΩ  [R0805]
R18  100Ω  [R0805]
R19  62kΩ  [R0603]
R20  4.99kΩ  [R0805]
R21  4.99kΩ  [R0805]
R22  62kΩ  [R0603]
R23  100mΩ  [R1206]
R24  100mΩ  [R1206]
R25  100mΩ  [R1206]
R26  2.2kΩ  [R0805]
U4  TX4131L  [SOP-8_L4.9-W3.9-P1.27-LS6.0-BL]
sheet P1
C5  22pF  [C0603]
C6  22pF  [C0603]
C9  10uF  [C0402]
C10  10uF  [C0402]
C18  100nF  [C0805]
C19  100nF  [C0805]
C20  100nF  [C0805]
C21  100nF  [C0805]
C22  100nF  [C0805]
C27  12pF  [C0805]
C28  12pF  [C0805]
C43  100nF  [C0805]
C44  100nF  [C0805]
H1  -  [HDR-TH_4P-P2.54-V-M]
LED1  NCD0805R1  [LED0805-R-RD]
LED2  KT-0805G  [LED0805-R-RD]
R12  1kΩ  [R0805]
R13  1kΩ  [R0805]
U1  STM32F103C8T6  [LQFP-48_L7.0-W7.0-P0.50-LS9.0-BL]
U12  AMS1117-3.3  [SOT-223-3_L6.5-W3.4-P2.30-LS7.0-BR]
X2  8MHz  [CRYSTAL-SMD_L11.5-W4.8-LS12.7]
X5  32.768kHz  [FC-135R_L3.2-W1.5]
sheet 接口
H2  -  [HDR-TH_4P-P2.54-V-M]
U8  ZX-HY2.0-8PWT  [CONN-SMD_8P-P2.00_WAFER-HY2.0-8PWB]
U9  ZX-HY2.0-7PWT  [CONN-SMD_7P-P2.00_ZX-HY2.0-7PWT]
sheet 电池电压
D11  BZT52C3V3S  [SOD-323_L1.7-W1.3-LS2.6-RD]
R42  62kΩ  [R0603]
R43  2kΩ  [R0805]
sheet 电池锁驱动
C35  4.7uF  [C0805]
C36  100nF  [C0805]
R39  10kΩ  [R0805]
ULocker  T1016H  [SOT-23-6_L2.9-W1.7-P0.95-LS2.8-BL]
sheet 给控制器供电
Q4  PJM10H01PSA  [SOT-23-3_L2.9-W1.3-P0.95-LS2.4-BR]
R35  10kΩ  [R0805]
R36  51kΩ  [R0805]
R37  10kΩ  [R0805]
U11  BSS123  [SOT-23-3_L2.9-W1.3-P1.90-LS2.4-BR]
sheet 蓝牙
U3  VG6328A  [COMM-SMD_VG6328A]
sheet 蜂鸣器
Q3  SS8050  [SOT-23-3_L2.9-W1.3-P1.90-LS2.4-BR]
R40  4.7kΩ  [R0805]
R44  10kΩ  [R0805]
sheet 轮动信号
C42  100nF  [C0805]
R45  10kΩ  [R0805]
R46  0Ω  [R0603]

## Library data of the parts
4GGPS = X6511WV-06H-C60D30: 插针结构:1x6P;间距:2.54mm;行距:2.54mm;圆针/方针:方针;安装类型:-;排数:单排;总PIN位数:6P;额定电流:3A;额定电压:250V;配合针长度:-;塑高:2.5mm;端接针长度:-;触头材质:黄铜;触头镀层:金;工作温度范围:-40℃~+105℃;焊接温度(最大值):260℃;颜色:黑色;; LCSC Part Name: 1x6P 间距:2.54mm 方针; Supplier Part: C706878; Manufacturer: XKB Connection(中国星坤); Supplier Footprint: 插件,P=2.54mm; JLCPCB Part Class: 扩展库; Datasheet: https://atta.szlcsc.com/upload/public/pdf/source/20221108/2FDDF9C694C8EDC81165E23F2EAAE597.pdf; Supplier: LCSC; Pin Structure: 1x6P; Pitch: 2.54mm; Row Spacing: 2.54mm; Circluar Pins/Square Pins: 方针; Number of Rows: 单排; Number of Pins: 6P; Current Rating (Max): 3A; Voltage Rating (Max): 250V; Insulation Height: 2.5mm; Contact Material: 黄铜; Contact Plating: 金; Operating Temperature Range: -40℃~+105℃; Soldering Temperature(Max): 260℃; Color: 黑色
C1 C18-C22 C36 C41-C44 = CC0805KRX7R9BB104: 容值:100nF;精度:±10%;额定电压:50V;材质(温度系数):X7R;; LCSC Part Name: 100nF ±10% 50V; Supplier Part: C49678; Manufacturer: YAGEO(国巨); Supplier Footprint: 0805; JLCPCB Part Class: Basic Part; Datasheet: https://atta.szlcsc.com/upload/public/pdf/source/20180224/C181747_15194369449651363981.pdf; Supplier: LCSC; Tolerance: ±10%; Voltage Rated: 50V; Temperature Coefficient: X7R
D6-D8 = SMBJ6.5CA_C7420377: 极性:双向;反向截止电压(Vrwm):6.5V;最大钳位电压:11.2V;峰值脉冲电流(Ipp)@10/1000us:53.57A;峰值脉冲功率(Ppp)@10/1000us:600W;击穿电压:7.22V;; Supplier Part: C7420377; Manufacturer: 宏迦橙; Supplier Footprint: SMB; JLCPCB Part Class: Extended Part; Datasheet: https://atta.szlcsc.com/upload/public/pdf/source/20240521/1CEEED45C5E1E6D6901B31DABD34A136.pdf; Supplier: LCSC; polarity: 双向; Reverse Stand-Off Voltage (Vrwm): 6.5V; Maximum Clamping Voltage: 11.2V; Peak Pulse Current (Ipp)@10/1000us: 53.57A; Peak Pulse Power Dissipation (Ppp)@10/1000us: 600W; Breakdown Voltage: 7.22V; Reverse Leakage Current (Ir): 500uA; Number of Lines: 单路; Operating Temperature: -55℃~+155℃; Type: TVS
Q2 Q3 = SS8050_C7420370: 晶体管类型:NPN;集电极电流(Ic):1.5A;集射极击穿电压(Vceo):25V;功率(Pd):300mW;直流电流增益(hFE@Ic,Vce):120@100mA,1.0V;; LCSC Part Name: 耐压:25V 电流:1.5A NPN H档 200-350; Supplier Part: C7420370; Manufacturer: 宏迦橙; Supplier Footprint: SOT-23; JLCPCB Part Class: Extended Part; Datasheet: https://atta.szlcsc.com/upload/public/pdf/source/20231222/9C4050A7669EB24B3ACD0418218817FD.pdf; Supplier: LCSC; Transistor Type: NPN; Collector Current (Ic): 1.5A; Collector-Emitter Breakdown Voltage (Vceo): 25V; Power Dissipation (Pd): 300mW; DC Current Gain (hFE@Ic,Vce): 120@100mA,1.0V; Transition Frequency (fT): 100MHz; Collector Cut-Off Current (Icbo): 100nA; Collector-Emitter Saturation Voltage (VCE(sat)@Ic,Ib): 500mV@800mA,80mA; Operating Temperature: -55℃~+150℃
R27-R30 R40 = 0805W8F4701T5E: 电阻类型:厚膜电阻;阻值:4.7kΩ;精度:±1%;功率:125mW;最大工作电压:150V;温度系数:±100ppm/℃;; LCSC Part Name: 4.7kΩ ±1% 125mW 厚膜电阻; Supplier Part: C17673; Manufacturer: UNI-ROYAL(厚声); Supplier Footprint: 0805; JLCPCB Part Class: Basic Part; Datasheet: https://atta.szlcsc.com/upload/public/pdf/source/20200306/C422600_1E6D84923E4A46A82E41ADD87F860B5C.pdf; Supplier: LCSC; Type: 厚膜电阻; Tolerance: ±1%; Power(Watts): 125mW; Overload Voltage (Max): 150V; Temperature Coefficient: ±100ppm/℃; Operating Temperature Range: -55℃~+155℃
R12 R13 R31 = 0805W8F1001T5E: 电阻类型:厚膜电阻;阻值:1kΩ;精度:±1%;功率:125mW;最大工作电压:150V;温度系数:±100ppm/℃;; LCSC Part Name: 1kΩ ±1% 125mW 厚膜电阻; Supplier Part: C17513; Manufacturer: UNI-ROYAL(厚声); Supplier Footprint: 0805; JLCPCB Part Class: Basic Part; Datasheet: https://atta.szlcsc.com/upload/public/pdf/source/20200306/C422600_1E6D84923E4A46A82E41ADD87F860B5C.pdf; Supplier: LCSC; Type: 厚膜电阻; Tolerance: ±1%; Power(Watts): 125mW; Overload Voltage (Max): 150V; Temperature Coefficient: ±100ppm/℃; Operating Temperature Range: -55℃~+155℃
U7 = SP3485EN-L/TR: Supplier: LCSC; Manufacturer: EXAR; image: //image.lceda.cn/szlcsc/C8963.jpg; Supplier Part: C8963; JLCPCB Part Class: Basic
C37 = RVT2A470M1010_C335988: 容值:47uF;精度:±20%;额定电压:100V;纹波电流:148mA@120Hz;等效串联电阻:-;; LCSC Part Name: 47uF ±20% 100V; Supplier Part: C335988; Manufacturer: ROQANG(容强); Manufacturer Part: RVT2A470M1010; Supplier Footprint: SMD,D10xL10.2mm; JLCPCB Part Class: Extended Part; Datasheet: https://atta.szlcsc.com/upload/public/pdf/source/20181128/C335987_23CA7AA50FB42690DF736C43FE112376.pdf; Supplier: LCSC; Tolerance: ±20%; Rated Voltage: 100V; Ripple Current: 148mA@120Hz; φD: 10mm; L: 10.2mm; Lifetime @ Temp: 2000hrs@105℃; Operating Temperature: -40℃~+105℃
C38 = CL21A225KBQNNNE: 容值:2.2uF;精度:±10%;额定电压:50V;材质(温度系数):X5R;; LCSC Part Name: 2.2uF ±10% 50V; Supplier Part: C377773; Manufacturer: SAMSUNG(三星); Supplier Footprint: 0805; JLCPCB Part Class: 基础库; Datasheet: https://atta.szlcsc.com/upload/public/pdf/source/20160218/1457707763339.pdf; Supplier: LCSC; Tolerance: ±10%; Voltage Rated: 50V; Temperature Coefficient: X5R
C35 C39 = CL21A475KAQNNNE: 容值:4.7uF;精度:±10%;额定电压:25V;材质(温度系数):X5R;; LCSC Part Name: 4.7uF ±10% 25V; Supplier Part: C1779; Manufacturer: SAMSUNG(三星); Supplier Footprint: 0805; JLCPCB Part Class: Basic Part; Datasheet: https://atta.szlcsc.com/upload/public/pdf/source/20160218/1457707763339.pdf; Supplier: LCSC; Tolerance: ±10%; Voltage Rated: 25V; Temperature Coefficient: X5R
C40 = RVT220UF16V67RV0015: 容值:220uF;精度:±20%;额定电压:16V;纹波电流:110mA@120Hz;等效串联电阻:-;; LCSC Part Name: 220uF ±20% 16V; Supplier Part: C2887273; Manufacturer: KNSCHA(科尼盛); Supplier Footprint: SMD,D6.3xL7.7mm; JLCPCB Part Class: 扩展库; Datasheet: https://atta.szlcsc.com/upload/public/pdf/source/20210824/3DC9999D9B098FE241E3A26137981C4C.pdf; Supplier: LCSC; Tolerance: ±20%; Rated Voltage: 16V; Ripple Current: 110mA@120Hz; φD: 6.3mm; L: 7.7mm; Lifetime @ Temp: 2000hrs@105℃; Operating Temperature: -55℃~+105℃
D2 = BZT52B12_C22395569: 二极管配置:独立式;稳压值(标称值):12V;稳压值(范围):11.76V~12.24V;功率(Pd):500mW;; Supplier Part: C22395569; Manufacturer: 宏迦橙; Supplier Footprint: SOD-123; JLCPCB Part Class: Extended Part; Datasheet: https://atta.szlcsc.com/upload/public/pdf/source/20240529/40AB9C1F2C1418D9F639D738010BB2C0.pdf; Supplier: LCSC; Diode Configuration: 独立式; Zener Voltage (Nom): 12V; Reverse Leakage Current (Ir): 100nA@8V; Zener Voltage (Range): 11.76V~12.24V; Power Dissipation: 500mW; Zener Impedance (Zzt): 25Ω; Tolerance: ±5%
D3 = 1N4148WS_C2128: 二极管配置:独立式;正向压降(Vf):1.25V@150mA;直流反向耐压(Vr):100V;平均整流电流(Io):150mA;功率:200mW;反向恢复时间(trr):4ns;; LCSC Part Name: 电压:100V 电流:150mA; Supplier Part: C2128; Manufacturer: CJ(江苏长电/长晶); Supplier Footprint: SOD-323; JLCPCB Part Class: Basic Part; Datasheet: https://atta.szlcsc.com/upload/public/pdf/source/20140809/1457707208178.pdf; Supplier: LCSC; Diode Configuration: 独立式; Forward Voltage (Vf@If): 1.25V@150mA; Reverse Voltage (Vr): 100V; Average Rectified Current (Io): 150mA; Power Dissipation: 200mW; Reverse Leakage Current: 1uA@75V; Reverse Recovery Time (trr): 4ns
D9 D10 = SS310_C7420364: 二极管配置:独立式;正向压降(Vf):850mV@3A;直流反向耐压(Vr):100V;整流电流:3A;; LCSC Part Name: 电压:100V 电流:3A; Supplier Part: C7420364; Manufacturer: 宏迦橙; Supplier Footprint: SMA(DO-214AC); JLCPCB Part Class: 扩展库; Datasheet: https://atta.szlcsc.com/upload/public/pdf/source/20230828/75438452AEE6C276EDA92B2AF599BE05.pdf; Supplier: LCSC; Diode Configuration: 独立式; Forward Voltage (Vf@If): 850mV@3A; Reverse Voltage (Vr): 100V; Rectified Current: 3A; Reverse Leakage Current (Ir): 50uA@100V
L1 = FXL0630-470-M: 电感值:47uH;精度:±20%;额定电流:1.5A;饱和电流(Isat):2A;类型:一体成型电感;; LCSC Part Name: 47uH ±20% 2A; Supplier Part: C475913; Manufacturer: cjiang(长江微电); Supplier Footprint: SMD,6.6x7mm; JLCPCB Part Class: 扩展库; Datasheet: https://atta.szlcsc.com/upload/public/pdf/source/20240426/3189EA8206330E2108542F9E34E540E7.pdf; Supplier: LCSC; Tolerance: ±20%; Rated Current: 1.5A; Saturation Current (Isat): 2A; DC Resistance (DCR): 385mΩ; Type: 一体成型电感
Q1 = TX15N10B: 类型:1个N沟道;漏源电压(Vdss):100V;连续漏极电流(Id):15A;功率(Pd):34.7W;导通电阻(RDS(on)@Vgs,Id):100mΩ@10V,8A;阈值电压(Vgs(th)@Id):3V@250uA;; LCSC Part Name: 1个N沟道 耐压:100V 电流:15A; Supplier Part: C448634; Manufacturer: XDS(芯鼎盛); Supplier Footprint: TO-252; JLCPCB Part Class: 扩展库; Datasheet: https://atta.szlcsc.com/upload/public/pdf/source/20230913/C9E0FE337A91CE44B631A41F6D28925C.pdf; Supplier: LCSC; Type: 1个N沟道; Drain Source Voltage (Vdss): 100V; Continuous Drain Current (Id): 15A; Power Dissipation (Pd): 34.7W; Drain Source On Resistance (RDS(on)@Vgs,Id): 100mΩ@10V,8A; Gate Threshold Voltage (Vgs(th)@Id): 3V@250uA
R17 R36 = 0805W8F5102T5E: 电阻类型:厚膜电阻;阻值:51kΩ;精度:±1%;功率:125mW;最大工作电压:150V;温度系数:±100ppm/℃;; LCSC Part Name: 51kΩ ±1% 125mW 厚膜电阻; Supplier Part: C17737; Manufacturer: UNI-ROYAL(厚声); Supplier Footprint: 0805; JLCPCB Part Class: Basic Part; Datasheet: https://atta.szlcsc.com/upload/public/pdf/source/20200306/C422600_1E6D84923E4A46A82E41ADD87F860B5C.pdf; Supplier: LCSC; Type: 厚膜电阻; Tolerance: ±1%; Power(Watts): 125mW; Overload Voltage (Max): 150V; Temperature Coefficient: ±100ppm/℃; Operating Temperature Range: -55℃~+155℃
R18 = 0805W8F1000T5E: 电阻类型:厚膜电阻;阻值:100Ω;精度:±1%;功率:125mW;最大工作电压:150V;温度系数:±100ppm/℃;; LCSC Part Name: 100Ω ±1% 125mW 厚膜电阻; Supplier Part: C17408; Manufacturer: UNI-ROYAL(厚声); Supplier Footprint: 0805; JLCPCB Part Class: Basic Part; Datasheet: https://atta.szlcsc.com/upload/public/pdf/source/20200306/C422600_1E6D84923E4A46A82E41ADD87F860B5C.pdf; Supplier: LCSC; Type: 厚膜电阻; Tolerance: ±1%; Power(Watts): 125mW; Overload Voltage (Max): 150V; Temperature Coefficient: ±100ppm/℃; Operating Temperature Range: -55℃~+155℃
R19 R22 R42 = 0603WAF6202T5E: 电阻类型:厚膜电阻;阻值:62kΩ;精度:±1%;功率:100mW;最大工作电压:75V;温度系数:±100ppm/℃;; LCSC Part Name: 62kΩ ±1% 100mW 厚膜电阻; Supplier Part: C23221; Manufacturer: UNI-ROYAL(厚声); Supplier Footprint: 0603; JLCPCB Part Class: Extended Part; Datasheet: https://atta.szlcsc.com/upload/public/pdf/source/20200306/C422600_1E6D84923E4A46A82E41ADD87F860B5C.pdf; Supplier: LCSC; Type: 厚膜电阻; Tolerance: ±1%; Power(Watts): 100mW; Overload Voltage (Max): 75V; Temperature Coefficient: ±100ppm/℃; Operating Temperature Range: -55℃~+155℃
R20 R21 = 0805W8F4991T5E: 电阻类型:厚膜电阻;阻值:4.99kΩ;精度:±1%;功率:125mW;最大工作电压:150V;温度系数:±100ppm/℃;; LCSC Part Name: 4.99kΩ ±1% 125mW 厚膜电阻; Supplier Part: C17677; Manufacturer: UNI-ROYAL(厚声); Supplier Footprint: 0805; JLCPCB Part Class: Extended Part; Datasheet: https://atta.szlcsc.com/upload/public/pdf/source/20200306/C422600_1E6D84923E4A46A82E41ADD87F860B5C.pdf; Supplier: LCSC; Type: 厚膜电阻; Tolerance: ±1%; Power(Watts): 125mW; Overload Voltage (Max): 150V; Temperature Coefficient: ±100ppm/℃; Operating Temperature Range: -55℃~+155℃
R23-R25 = 1206W4F100LT5E: 电阻类型:厚膜电阻;阻值:100mΩ;精度:±1%;功率:250mW;最大工作电压:200V;温度系数:±800ppm/℃;; LCSC Part Name: 100mΩ ±1% 250mW 厚膜电阻; Supplier Part: C25334; Manufacturer: UNI-ROYAL(厚声); Supplier Footprint: 1206; JLCPCB Part Class: Basic Part; Datasheet: https://atta.szlcsc.com/upload/public/pdf/source/20200306/C422600_1E6D84923E4A46A82E41ADD87F860B5C.pdf; Supplier: LCSC; Type: 厚膜电阻; Tolerance: ±1%; Power(Watts): 250mW; Overload Voltage (Max): 200V; Temperature Coefficient: ±800ppm/℃; Operating Temperature Range: -55℃~+155℃; Mounting Sytle: 贴片
R26 = 0805W8F2201T5E: 电阻类型:厚膜电阻;阻值:2.2kΩ;精度:±1%;功率:125mW;最大工作电压:150V;温度系数:±100ppm/℃;; LCSC Part Name: 2.2kΩ ±1% 125mW 厚膜电阻; Supplier Part: C17520; Manufacturer: UNI-ROYAL(厚声); Supplier Footprint: 0805; JLCPCB Part Class: Basic Part; Datasheet: https://atta.szlcsc.com/upload/public/pdf/source/20200306/C422600_1E6D84923E4A46A82E41ADD87F860B5C.pdf; Supplier: LCSC; Type: 厚膜电阻; Tolerance: ±1%; Power(Watts): 125mW; Overload Voltage (Max): 150V; Temperature Coefficient: ±100ppm/℃; Operating Temperature Range: -55℃~+155℃
U4 = TX4131L_C19192514: Supplier Part: C19192514; Manufacturer: XDS(芯鼎盛); Supplier Footprint: SOP-8; JLCPCB Part Class: 扩展库; Datasheet: https://atta.szlcsc.com/upload/public/pdf/source/20230419/B8924B4823D388E617156A7649B52883.pdf; Supplier: LCSC
C5 C6 = CL10C220JB8NNNC: 容值:22pF;精度:±5%;额定电压:50V;材质(温度系数):C0G;; LCSC Part Name: 22pF ±5% 50V; Supplier Part: C1653; Manufacturer: SAMSUNG(三星); Supplier Footprint: 0603; JLCPCB Part Class: Basic Part; Datasheet: https://atta.szlcsc.com/upload/public/pdf/source/20160218/1457707763339.pdf; Supplier: LCSC; Tolerance: ±5%; Voltage Rated: 50V; Temperature Coefficient: C0G
C9 C10 = CL05A106MQ5NUNC: 容值:10uF;精度:±20%;额定电压:6.3V;材质(温度系数):X5R;; LCSC Part Name: 10uF ±20% 6.3V; Supplier Part: C15525; Manufacturer: SAMSUNG(三星); Supplier Footprint: 0402; JLCPCB Part Class: Basic Part; Datasheet: https://atta.szlcsc.com/upload/public/pdf/source/20220823/2B02EE04F8F211D38A52DCB16EB6BEBA.pdf; Supplier: LCSC; Tolerance: ±20%; Voltage Rated: 6.3V; Temperature Coefficient: X5R
C27 C28 = 0805CG120J500NT: 容值:12pF;精度:±5%;额定电压:50V;材质(温度系数):C0G;; LCSC Part Name: 12pF ±5% 50V; Supplier Part: C1792; Manufacturer: FH(风华); Supplier Footprint: 0805; JLCPCB Part Class: Extended Part; Datasheet: https://atta.szlcsc.com/upload/public/pdf/source/20200305/C486355_26A10D38EF8C2A5C37091D0039909270.pdf; Supplier: LCSC; Tolerance: ±5%; Voltage Rated: 50V; Temperature Coefficient: C0G
H1 H2 = HDR-M_2.54_1x4P: Supplier Part: C2935929; Supplier Footprint: 插件
LED1 = NCD0805R1: 灯头类型:-;发光颜色:红色;正向电压(VF):1.6V~2.6V;功率:65mW;正向电流:20mA;主波长:615nm~630nm;二极管配置:独立二极管;透镜颜色:无色透明透镜;色温:-;发光强度:67mcd~195mcd;发光角度:130°;载带方式:-;工作温度:-30℃~+85℃;; Supplier Part: C84256; Manufacturer: 国星光电; Supplier Footprint: 0805; JLCPCB Part Class: Basic Part; Datasheet: https://atta.szlcsc.com/upload/public/pdf/source/20200820/C84256_F0A75A43B3EAD75808600A0514C76B99.pdf; Supplier: LCSC; Emitted Color: 红色; Forward Voltage (VF): 1.6V~2.6V; Power Dissipation: 65mW; Forward Current: 20mA; Dominant Wavelength: 615nm~630nm; Diode Configuration: 独立二极管; Lens Color: 无色透明透镜; Luminous Intensity: 67mcd~195mcd; Viewing Angle: 130°; Operating Temperature: -30℃~+85℃
LED2 = KT-0805G: 灯头类型:-;发光颜色:翠绿色;正向电压(VF):-;功率:-;正向电流:-;主波长:-;二极管配置:-;透镜颜色:-;色温:-;发光强度:-;发光角度:-;载带方式:-;工作温度:-;; LCSC Part Name: 0805 翠绿 高亮; Supplier Part: C2297; Manufacturer: KENTO; Supplier Footprint: 0805; JLCPCB Part Class: Basic Part; Datasheet: https://atta.szlcsc.com/upload/public/pdf/source/20170209/1486607340485.pdf; Supplier: LCSC; Emitted Color: 翠绿色
U1 = STM32F103C8T6: CPU内核:ARM-M3;程序存储容量:64KB;RAM总容量:20KB;GPIO端口数量:37;工作电压范围:2V~3.6V;CPU最大主频:72MHz;程序存储器类型:FLASH;; Supplier Part: C8734; Manufacturer: ST(意法半导体); Supplier Footprint: LQFP-48(7x7); JLCPCB Part Class: 扩展库; Datasheet: https://atta.szlcsc.com/upload/public/pdf/source/20220812/8363ACEC51AD55ECEB84799464F7CB85.pdf; Supplier: LCSC; CPU Core: ARM-M3; Program Storage Size: 64KB; RAM Size: 20KB; GPIO Ports Number: 37; Operating Voltage Range: 2V~3.6V; CPU Maximum Speed: 72MHz; Program Memory Type: FLASH; Operating Temperature Range: -40℃~+85℃; ADC (Bit): 12bit; Universal Serial Bus: 有; Peripheral/Function: 看门狗；DMA；看门狗；温度传感器; Watchdog: 有; Infrared Data Association: 有; Low-Voltage Detect: 有; Direct Memory Access: 有; Internal Oscillator: 有
U12 = AMS1117-3.3_C6186: 输出类型:固定;最大输入电压:-;输出电压:3.3V;最大输出电流:1A;电源纹波抑制比(PSRR):72dB@(120Hz);输出极性:正极;; LCSC Part Name: 输出3.3V 1A; Supplier Part: C6186; Manufacturer: AMS; Supplier Footprint: SOT-223; JLCPCB Part Class: Basic Part; Datasheet: https://atta.szlcsc.com/upload/public/pdf/source/20180727/C6186_7A095716F0823C02F1997A905E26C086.pdf; Supplier: LCSC; Output Type: 固定; Output Voltage: 3.3V; MAX Output Current: 1A; Power Supply Rejection Ratio (PSRR): 72dB@(120Hz); Dropout Voltage: 1.3V@(800mA); Output Polarity: 正极; Number of Outputs: 1; Output Current: 1A
X2 = X49SM8MSD2SC: 晶振类型:贴片晶振;频率:8MHz;常温频差:±20ppm;外接负载电容:20pF;频率稳定度(全温):±30ppm;; LCSC Part Name: 8MHz ±20ppm 20pF; Supplier Part: C12674; Manufacturer: YXC(扬兴晶振); Supplier Footprint: HC-49S-SMD; JLCPCB Part Class: Basic Part; Datasheet: https://atta.szlcsc.com/upload/public/pdf/source/20240329/3EBF42EBCAB50CA65B6FA9D7CFA1955A.pdf; Supplier: LCSC; Crystal Type: 贴片晶振; Normal temperature Frequency Tolerance: ±20ppm; External load capacitor: 20pF; Frequency Stability(Full temperature range): ±30ppm; Operating Temperature: -20℃~+70℃; Frequency Tolerance: ±20ppm; Frequency Stability: ±30ppm; Load Capacitance: 20pF; Equivalent Series Resistance (ESR): 60Ω
X5 = Q13FC13500004_C32346: 晶振类型:贴片晶振;频率:32.768kHz;常温频差:±20ppm;外接负载电容:12.5pF;; LCSC Part Name: 32.768kHz ±20ppm 12.5pF; Supplier Part: C32346; Manufacturer: EPSON(爱普生); Manufacturer Part: Q13FC13500004; Supplier Footprint: SMD3215-2P; JLCPCB Part Class: Basic Part; Datasheet: https://atta.szlcsc.com/upload/public/pdf/source/20240418/0E0FF5F0356BA3753F616001439D1416.pdf; Supplier: LCSC; Crystal Type: 贴片晶振; Normal temperature Frequency Tolerance: ±20ppm; External load capacitor: 12.5pF; Equivalent Series Resistance (ESR): 70kΩ; Operating Temperature: -40℃~+85℃
U8 = ZX-HY2.0-8PWT: 插针结构:1x8P;间距:2mm;安装方式:卧贴;参考系列:HY;总PIN数:8P;排数:1;每排PIN数:8;行距:-;额定电流:2A;触头材质:黄铜;触头镀层:锡;工作温度范围:-25℃~+85℃;; LCSC Part Name: 1x8P 间距:2mm 卧贴 系列:HY; Supplier Part: C7429575; Manufacturer: Megastar(兆星); Supplier Footprint: SMD,P=2mm,卧贴; JLCPCB Part Class: 扩展库; Datasheet: https://atta.szlcsc.com/upload/public/pdf/source/20230619/055AF385CDB3A7A67019E7A4065BB86F.pdf; Supplier: LCSC; Pins Structure: 1x8P; Pitch: 2mm; Mounting Style: 卧贴; Reference Series: HY; Number of Pins: 8P; Number of Rows: 1; Number of PINs Per Row: 8; Current Rating (Max): 2A; Contact Material: 黄铜; Contact Plating: 锡; Operating Temperature Range: -25℃~+85℃
U9 = ZX-HY2.0-7PWT: 插针结构:1x7P;间距:2mm;安装方式:卧贴;参考系列:HY;总PIN数:7P;排数:1;每排PIN数:7;行距:-;额定电流:2A;触头材质:黄铜;触头镀层:锡;工作温度范围:-25℃~+85℃;; LCSC Part Name: 1x7P 间距:2mm 卧贴 系列:HY; Supplier Part: C7429574; Manufacturer: Megastar(兆星); Supplier Footprint: SMD,P=2mm,卧贴; JLCPCB Part Class: 扩展库; Datasheet: https://atta.szlcsc.com/upload/public/pdf/source/20230619/97F9BA3F044647EED4A6793F9A05A230.pdf; Supplier: LCSC; Pins Structure: 1x7P; Pitch: 2mm; Mounting Style: 卧贴; Reference Series: HY; Number of Pins: 7P; Number of Rows: 1; Number of PINs Per Row: 7; Current Rating (Max): 2A; Contact Material: 黄铜; Contact Plating: 锡; Operating Temperature Range: -25℃~+85℃
D11 = BZT52C3V3S_C19077437: 二极管配置:独立式;稳压值(标称值):3.3V;稳压值(范围):3.1V~3.5V;功率(Pd):200mW;; Supplier Part: C19077437; Manufacturer: 宏迦橙; Supplier Footprint: SOD-323; JLCPCB Part Class: 扩展库; Datasheet: https://atta.szlcsc.com/upload/public/pdf/source/20231117/06CD1C2A69B3FFC97FEAE4263E1B2FE9.pdf; Supplier: LCSC; Diode Configuration: 独立式; Zener Voltage (Nom): 3.3V; Reverse Leakage Current (Ir): 5uA@1V; Zener Voltage (Range): 3.1V~3.5V; Power Dissipation: 200mW; Zener Impedance (Zzt): 95Ω
R43 = 0805W8F2001T5E: 电阻类型:厚膜电阻;阻值:2kΩ;精度:±1%;功率:125mW;最大工作电压:150V;温度系数:±100ppm/℃;; LCSC Part Name: 2kΩ ±1% 125mW 厚膜电阻; Supplier Part: C17604; Manufacturer: UNI-ROYAL(厚声); Supplier Footprint: 0805; JLCPCB Part Class: Basic Part; Datasheet: https://atta.szlcsc.com/upload/public/pdf/source/20200306/C422600_1E6D84923E4A46A82E41ADD87F860B5C.pdf; Supplier: LCSC; Type: 厚膜电阻; Tolerance: ±1%; Power(Watts): 125mW; Overload Voltage (Max): 150V; Temperature Coefficient: ±100ppm/℃; Operating Temperature Range: -55℃~+155℃
R35 R37 R39 R44 R45 = 0805W8F1002T5E_C17414: 电阻类型:厚膜电阻;阻值:10kΩ;精度:±1%;功率:125mW;最大工作电压:150V;温度系数:±100ppm/℃;; LCSC Part Name: 10kΩ ±1% 125mW 厚膜电阻; Supplier Part: C17414; Manufacturer: UNI-ROYAL(厚声); Manufacturer Part: 0805W8F1002T5E; Supplier Footprint: 0805; JLCPCB Part Class: Basic Part; Datasheet: https://atta.szlcsc.com/upload/public/pdf/source/20200306/C422600_1E6D84923E4A46A82E41ADD87F860B5C.pdf; Supplier: LCSC; Type: 厚膜电阻; Tolerance: ±1%; Power(Watts): 125mW; Overload Voltage (Max): 150V; Temperature Coefficient: ±100ppm/℃; Operating Temperature Range: -55℃~+155℃
ULocker = T1016H: LCSC Part Name: 单通道H桥马达驱动器; Supplier Part: C5142991; Manufacturer: FM(富满); Supplier Footprint: SOT-23-6; JLCPCB Part Class: 扩展库; Datasheet: https://atta.szlcsc.com/upload/public/pdf/source/20221108/DF659454ABCE57FF276A03E9D954DD3F.pdf; Supplier: LCSC
Q4 = PJM10H01PSA: 类型:1个P沟道;漏源电压(Vdss):100V;连续漏极电流(Id):1A;功率(Pd):500mW;导通电阻(RDS(on)@Vgs,Id):650mΩ@10V,1A;阈值电压(Vgs(th)@Id):2.5V@250uA;; LCSC Part Name: 1个P沟道 耐压:100V 电流:1A; Supplier Part: C2838029; Manufacturer: PJSEMI(平晶微); Supplier Footprint: SOT-23; JLCPCB Part Class: 扩展库; Datasheet: https://atta.szlcsc.com/upload/public/pdf/source/20230302/2D1030179683FC1715DC1F242D36E27F.pdf; Supplier: LCSC; Type: 1个P沟道; Drain Source Voltage (Vdss): 100V; Continuous Drain Current (Id): 1A; Power Dissipation (Pd): 500mW; Drain Source On Resistance (RDS(on)@Vgs,Id): 650mΩ@10V,1A; Gate Threshold Voltage (Vgs(th)@Id): 2.5V@250uA; Total Gate Charge (Qg@Vgs): 4nC@10V
U11 = BSS123_C7420338: 类型:N沟道;漏源电压(Vdss):100V;连续漏极电流(Id):200mA;功率(Pd):350mW;导通电阻(RDS(on)@Vgs,Id):5Ω@10V,0.2A;阈值电压(Vgs(th)@Id):2.5V@250uA;; LCSC Part Name: N沟道 耐压:100V 电流:200mA; Supplier Part: C7420338; Manufacturer: 宏迦橙; Supplier Footprint: SOT-23; JLCPCB Part Class: Extended Part; Datasheet: https://atta.szlcsc.com/upload/public/pdf/source/20230828/221D2EA3EA52D2251D08D49BEAAE0395.pdf; Supplier: LCSC; Type: N沟道; Drain Source Voltage (Vdss): 100V; Continuous Drain Current (Id): 200mA; Power Dissipation (Pd): 350mW; Drain Source On Resistance (RDS(on)@Vgs,Id): 5Ω@10V,0.2A; Gate Threshold Voltage (Vgs(th)@Id): 2.5V@250uA; Total Gate Charge (Qg@Vgs): 1.4nC@10V; Input Capacitance (Ciss@Vds): 32pF@50V; Reverse Transfer Capacitance (Crss@Vds): 7pF@50V; Operating Temperature: -55℃~+150℃
U3 = VG6328A: VG6328A 蓝牙透传是一款从机蓝牙透传模块。 / AT 指令模式：用户可以通过相应指令集对模块的参数进行查询或配置。 / 串口默认参数： 波特率(115200 baud)， 8个数据位， 1个停止位， 无奇偶校验位。 / 串口向模块发的数据包一包不要超过255个字节，否则会溢出导致数据出错。 / APP向模块发的数据包一包不要超过4096个字节。 / 广播间隔：100MS。 / 支持 AT 模式： 用户也可以通过串口AT 指令，对模块支持的参数进行修改 / （例如： 串口波特率、蓝牙设备名等）。 / 支持透传模式： 用户可以通过模; LCSC Part Name: 6328A低成本串口蓝牙模块; Supplier Part: C20539408; Manufacturer: Vollgo(沃进); Supplier Footprint: SMD,16x13.6mm; JLCPCB Part Class: 扩展库; Datasheet: https://atta.szlcsc.com/upload/public/pdf/source/20240112/5EEE1D6A89302B67E38E5FC88F83A793.pdf; Supplier: LCSC
R46 = 0603WAF0000T5E: 电阻类型:厚膜电阻;阻值:0Ω;精度:±1%;功率:100mW;最大工作电压:75V;; LCSC Part Name: 0Ω ±1% 100mW 厚膜电阻; Supplier Part: C21189; Manufacturer: UNI-ROYAL(厚声); Supplier Footprint: 0603; JLCPCB Part Class: Basic Part; Datasheet: https://atta.szlcsc.com/upload/public/pdf/source/20200306/C422600_1E6D84923E4A46A82E41ADD87F860B5C.pdf; Supplier: LCSC; Type: 厚膜电阻; Tolerance: ±1%; Power(Watts): 100mW; Overload Voltage (Max): 75V; Operating Temperature Range: -55℃~+155℃; Temperature Coefficient: ±800ppm/℃

## Nets
3V3: C1.1 C10.2 C18.2 C19.2 C20.2 C21.2 C22.2 C44.2 H1.4 H2.2 R12.2 R27.1 R30.2 R39.1 U1.9(VDDA) U1.24(VDD_1) U1.36(VDD_2) U1.48(VDD_3) U3.4(VDD) U7.8(VCC) U9.1 U12.4(TAB)
+5V: 4GGPS.5 C9.2 C35.2 C40.1 C41.2 C43.2 D3.2(A) L1.2 R19.1 R26.2 U8.8 U12.3(VIN) ULocker.5(VDD)
AGND: C38.1 C39.1 D2.2(A) L1.1 R20.2 R21.1 R23.1 R24.1 R25.1 U4.6(VSN) U4.7(VSS)
GND: 4GGPS.4 C1.2 C5.1 C6.1 C9.1 C10.1 C18.1 C19.1 C20.1 C21.1 C22.1 C27.1 C28.1 C35.1 C37.2 C40.2 C41.1 C42.1 C43.1 C44.1 D6.2(A) D7.1(K) D9.1(A) D10.1(A) D11.2(A) H1.1 H2.1 LED1.1(C) LED2.1(C) Q2.2(E) Q3.2(E) R22.2 R26.1 R28.2 R35.2 R43.1 R44.2 R45.2 U1.8(VSSA) U1.23(VSS_1) U1.35(VSS_2) U1.47(VSS_3) U3.3(GND) U7.4(DI) U7.5(GND) U8.4 U9.5 U11.2(S) U12.1(ADJ(GND)) ULocker.2(GND)
VBAT: U1.1(VBAT)
485A: D6.1(K) D8.2(A) R27.2 U7.6(A) U8.5
485B: D7.2(A) D8.1(K) R28.1 U7.7(B) U8.6
BOOT0: U1.44(BOOT0)
BOOT1: U1.20(PB2)
DIANMEN: Q4.3(D) U8.2
LOCKER1(RED): C36.2 U9.7 ULocker.6(OUTB)
LOCKER2(BLACK): C36.1 U9.6 ULocker.4(OUTA)
NRST: U1.7(NRST)
OSC32_IN: C27.2 U1.3(PC14-OSC32_IN) X5.1
OSC32_OUT: C28.2 U1.4(PC15-OSC32_OUT) X5.2
OSC_IN: C5.2 U1.5(PD0-OSC_IN) X2.2
OSC_OUT: C6.2 U1.6(PD1-OSC_OUT) X2.1
PA0: C42.2 R45.1 R46.1 U1.10(PA0-WKUP)
PA1: U1.11(PA1) U3.5(LED)
PA2: 4GGPS.2 U1.12(PA2)
PA3: 4GGPS.3 U1.13(PA3)
PA4: U1.14(PA4) ULocker.3(INA)
PA5: R39.2 U1.15(PA5) U9.4
PA6: U1.16(PA6) ULocker.1(INB)
PA7: R35.1 U1.17(PA7) U11.1(G)
PA8: U1.29(PA8)
PA9/USART1_TX: R29.1 U1.30(PA9)
PA10/USART1_RX: R31.1 U1.31(PA10)
PA13/SWDIO: H1.3 U1.34(PA13) U9.2
PA14/SWCLK: H1.2 U1.37(PA14) U9.3
PA15: U1.38(PA15)
PB0: R40.1 U1.18(PB0)
PB1: D11.1(K) R42.2 R43.2 U1.19(PB1)
PB3: U1.39(PB3)
PB4: U1.40(PB4)
PB5: U1.41(PB5)
PB6: 4GGPS.6 U1.42(PB6)
PB7: 4GGPS.1 U1.43(PB7)
PB8: H2.3 U1.45(PB8)
PB9: H2.4 U1.46(PB9)
PB10: U1.21(PB10) U3.1(RXD)
PB11: U1.22(PB11) U3.2(TXD)
PB12: U1.25(PB12)
PB13: U1.26(PB13)
PB14: U1.27(PB14)
PB15: U1.28(PB15)
PC13: R13.2 U1.2(PC13-TAMPER-RTC)
SPK1: Q3.3(C) U8.7
USB_D+_PA12: U1.33(PA12)
USB_D-_PA11: U1.32(PA11)
VDC+: C37.1 Q1.2(D) Q4.2(S) R17.2 R37.1 R42.1 U8.1
WHEEL: R46.2 U8.3
$1N2074: LED1.2(A) R12.1
$1N2077: LED2.2(A) R13.1
$4N4676: C39.2 U4.5(LDO)
$4N4693: R19.2 R20.1 U4.3(FB1)
$4N4698: Q1.1(G) U4.1(DRV)
$4N4701: R21.2 R22.1 U4.4(FB2)
$4N4703: C38.2 D2.1(K) R17.1 R18.2 U4.2(VDD)
$4N4719: D3.1(K) R18.1
$4N4723: D9.2(K) D10.2(K) Q1.3(S) R23.2 R24.2 R25.2 U4.8(VSP)
$6N472: Q2.3(C) R30.1 U7.2(RE#) U7.3(DE)
$6N475: R31.2 U7.1(RO)
$6N478: Q2.1(B) R29.2
$8N1397: R36.1 U11.3(D)
$11N115: Q3.1(B) R40.2 R44.1
Net-(Q4-1): Q4.1(G) R36.2

Not connected (* = marked no-connect by the designer): R37 2; U8 9 10; U9 8 9; U12 2(VOUT(TAB))

## Notes on the sheets
sheet 1
- AMS1117降压
- Type-C供电/下载
- LDO-5V转3.3V电路
- LED指示电路
- 复位电路
- BOOT模式选择
- 主控电源滤波
- 拓展排针接口
- SWD下载接口
- STM32F103C8T6
- 晶振电路
sheet 5
- 自动收发RS485电路
